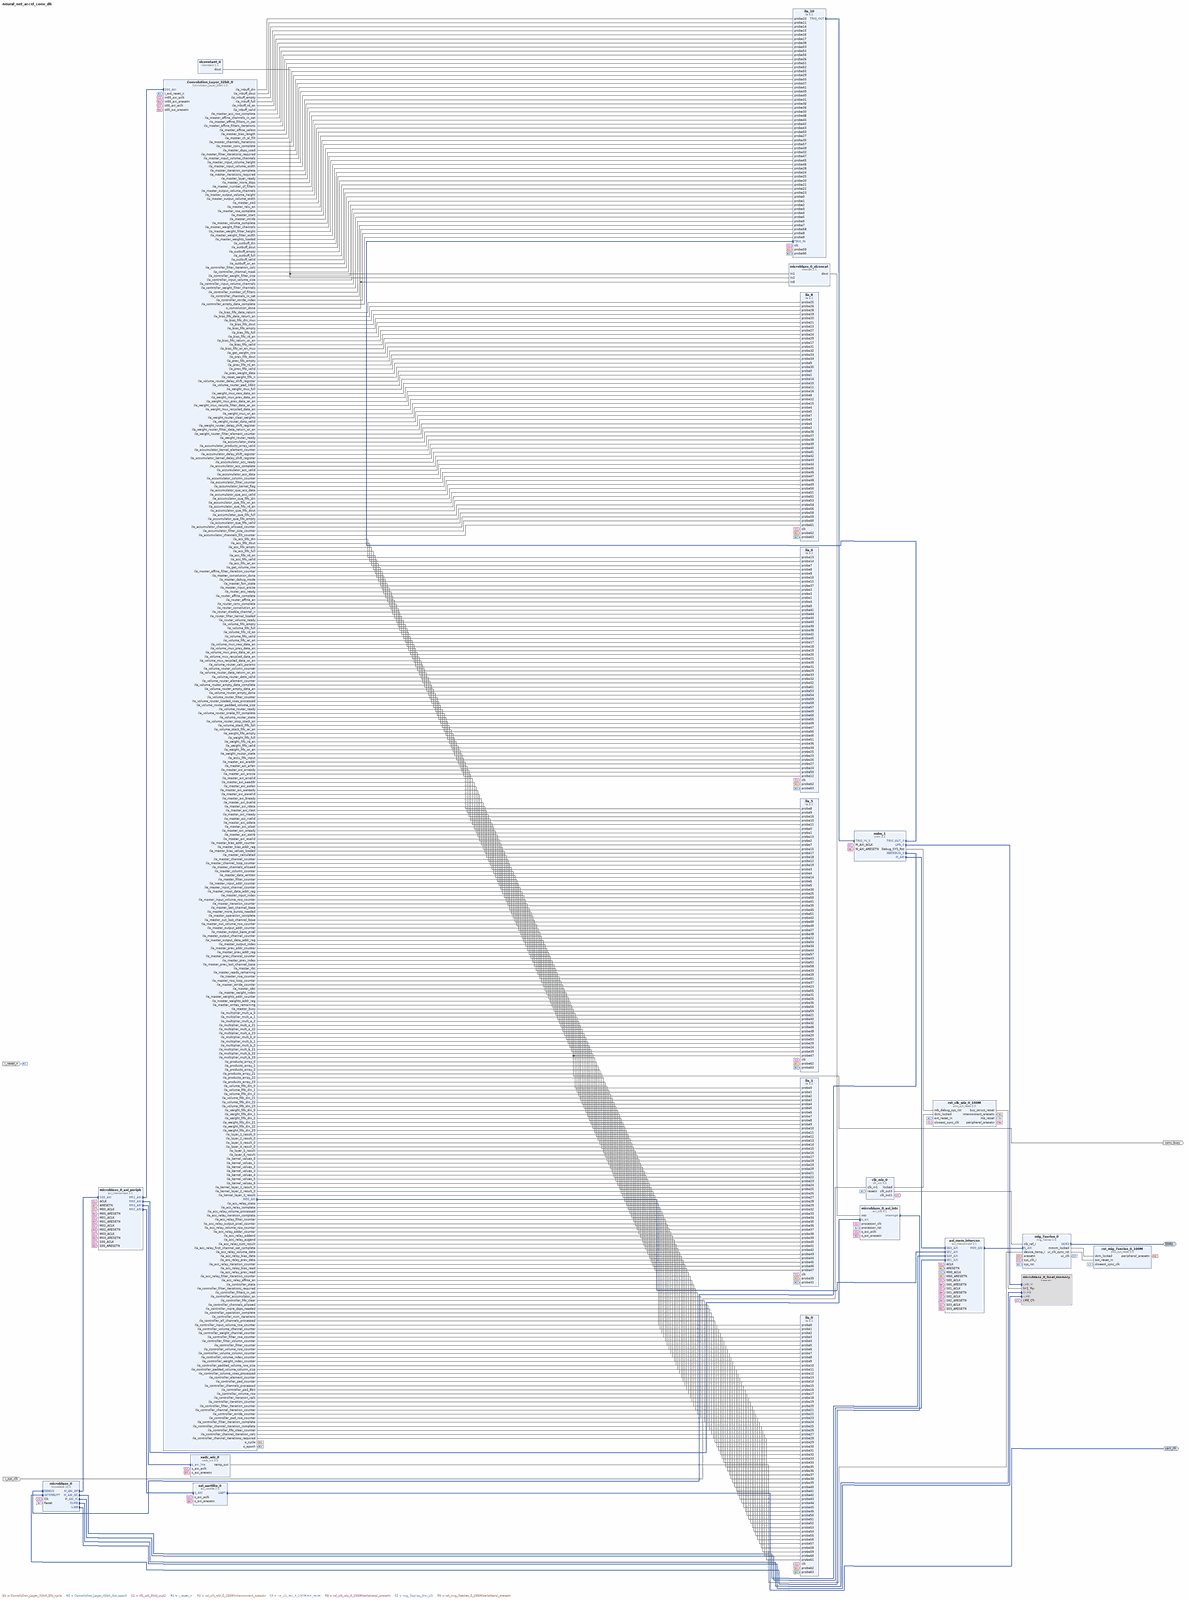
[diagram p0: block diagram of the top level, whole]
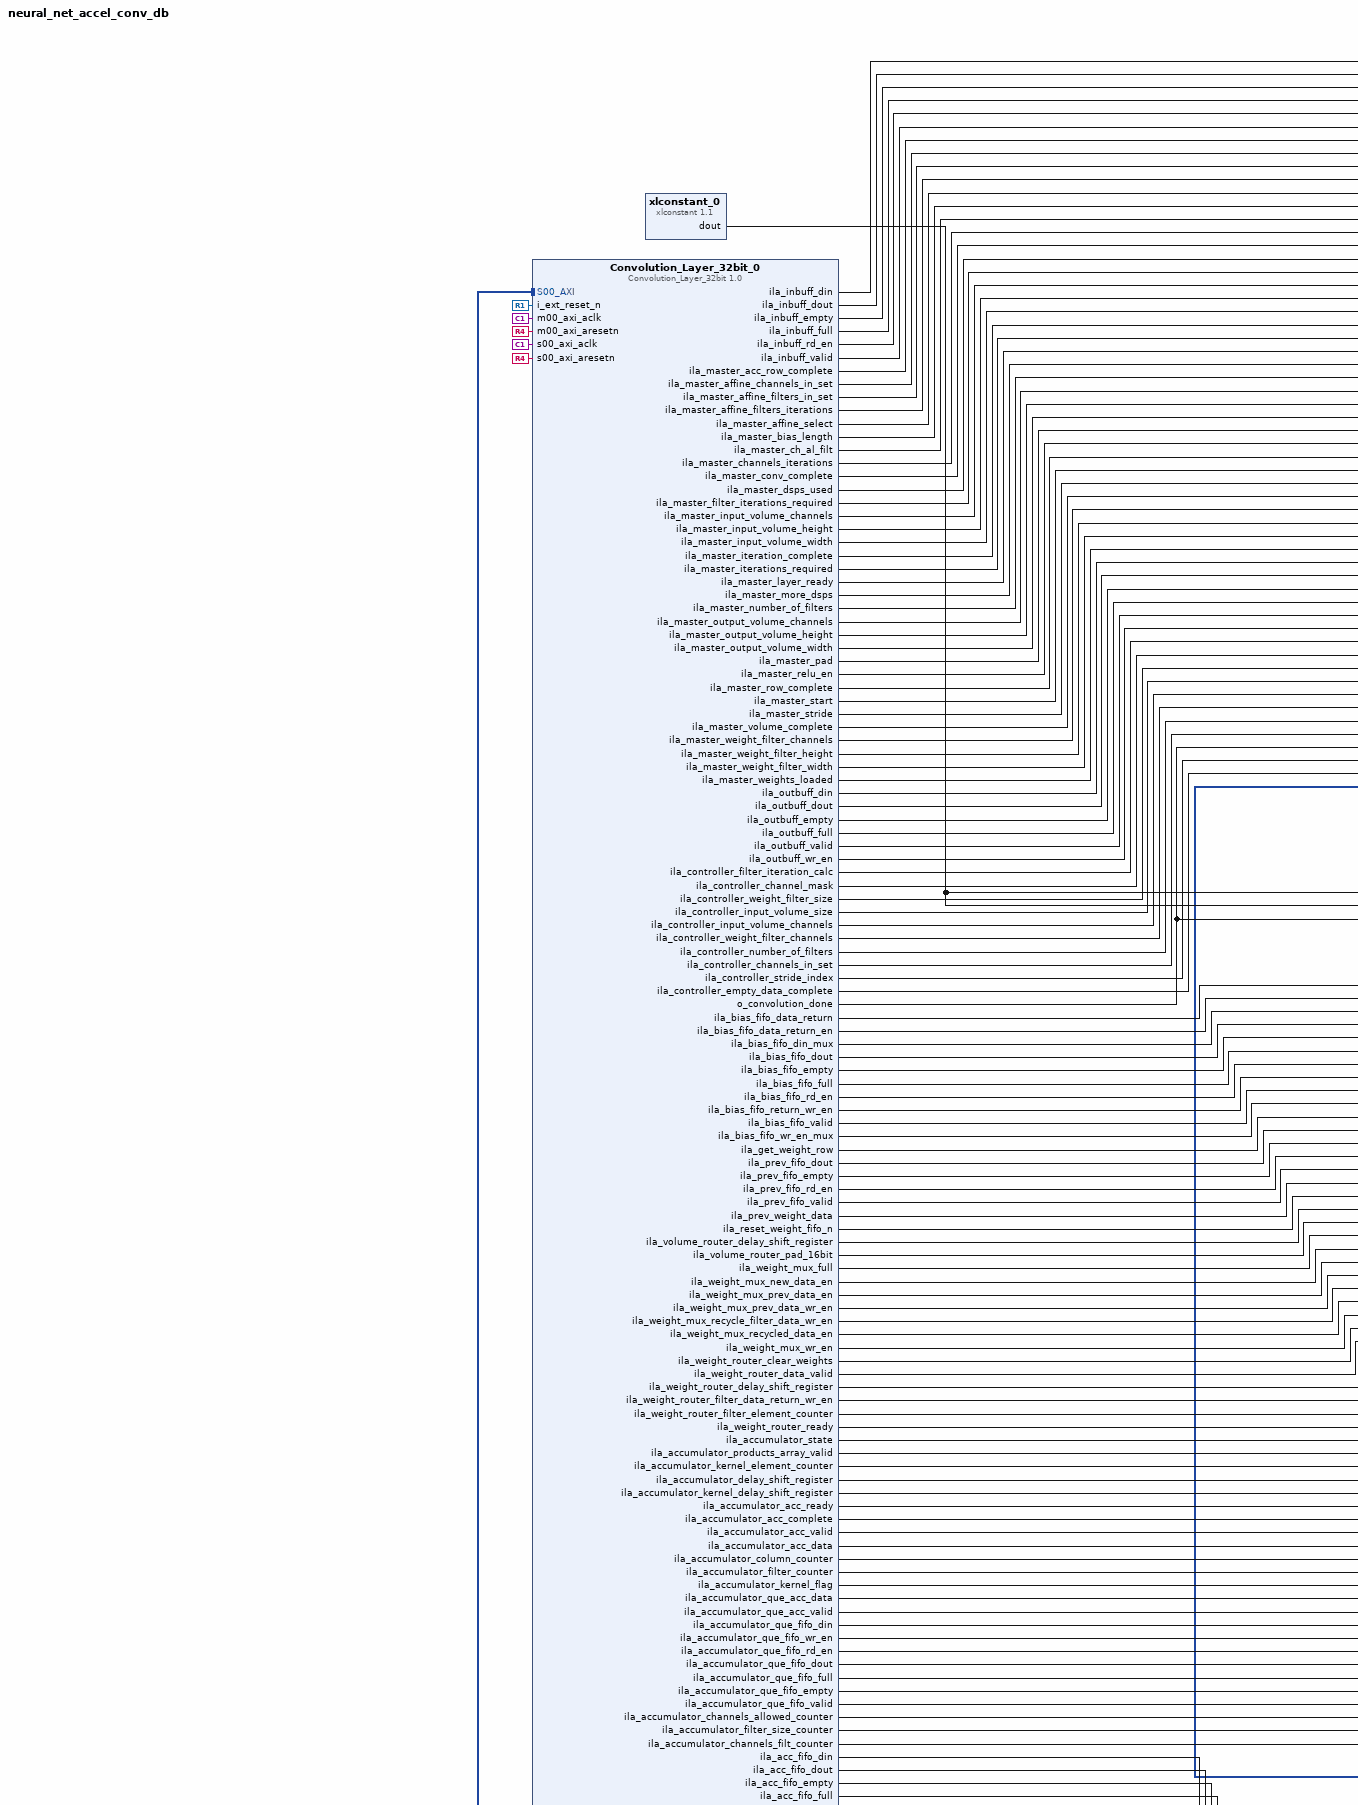
[diagram p1: block diagram of the top level, upper left part]
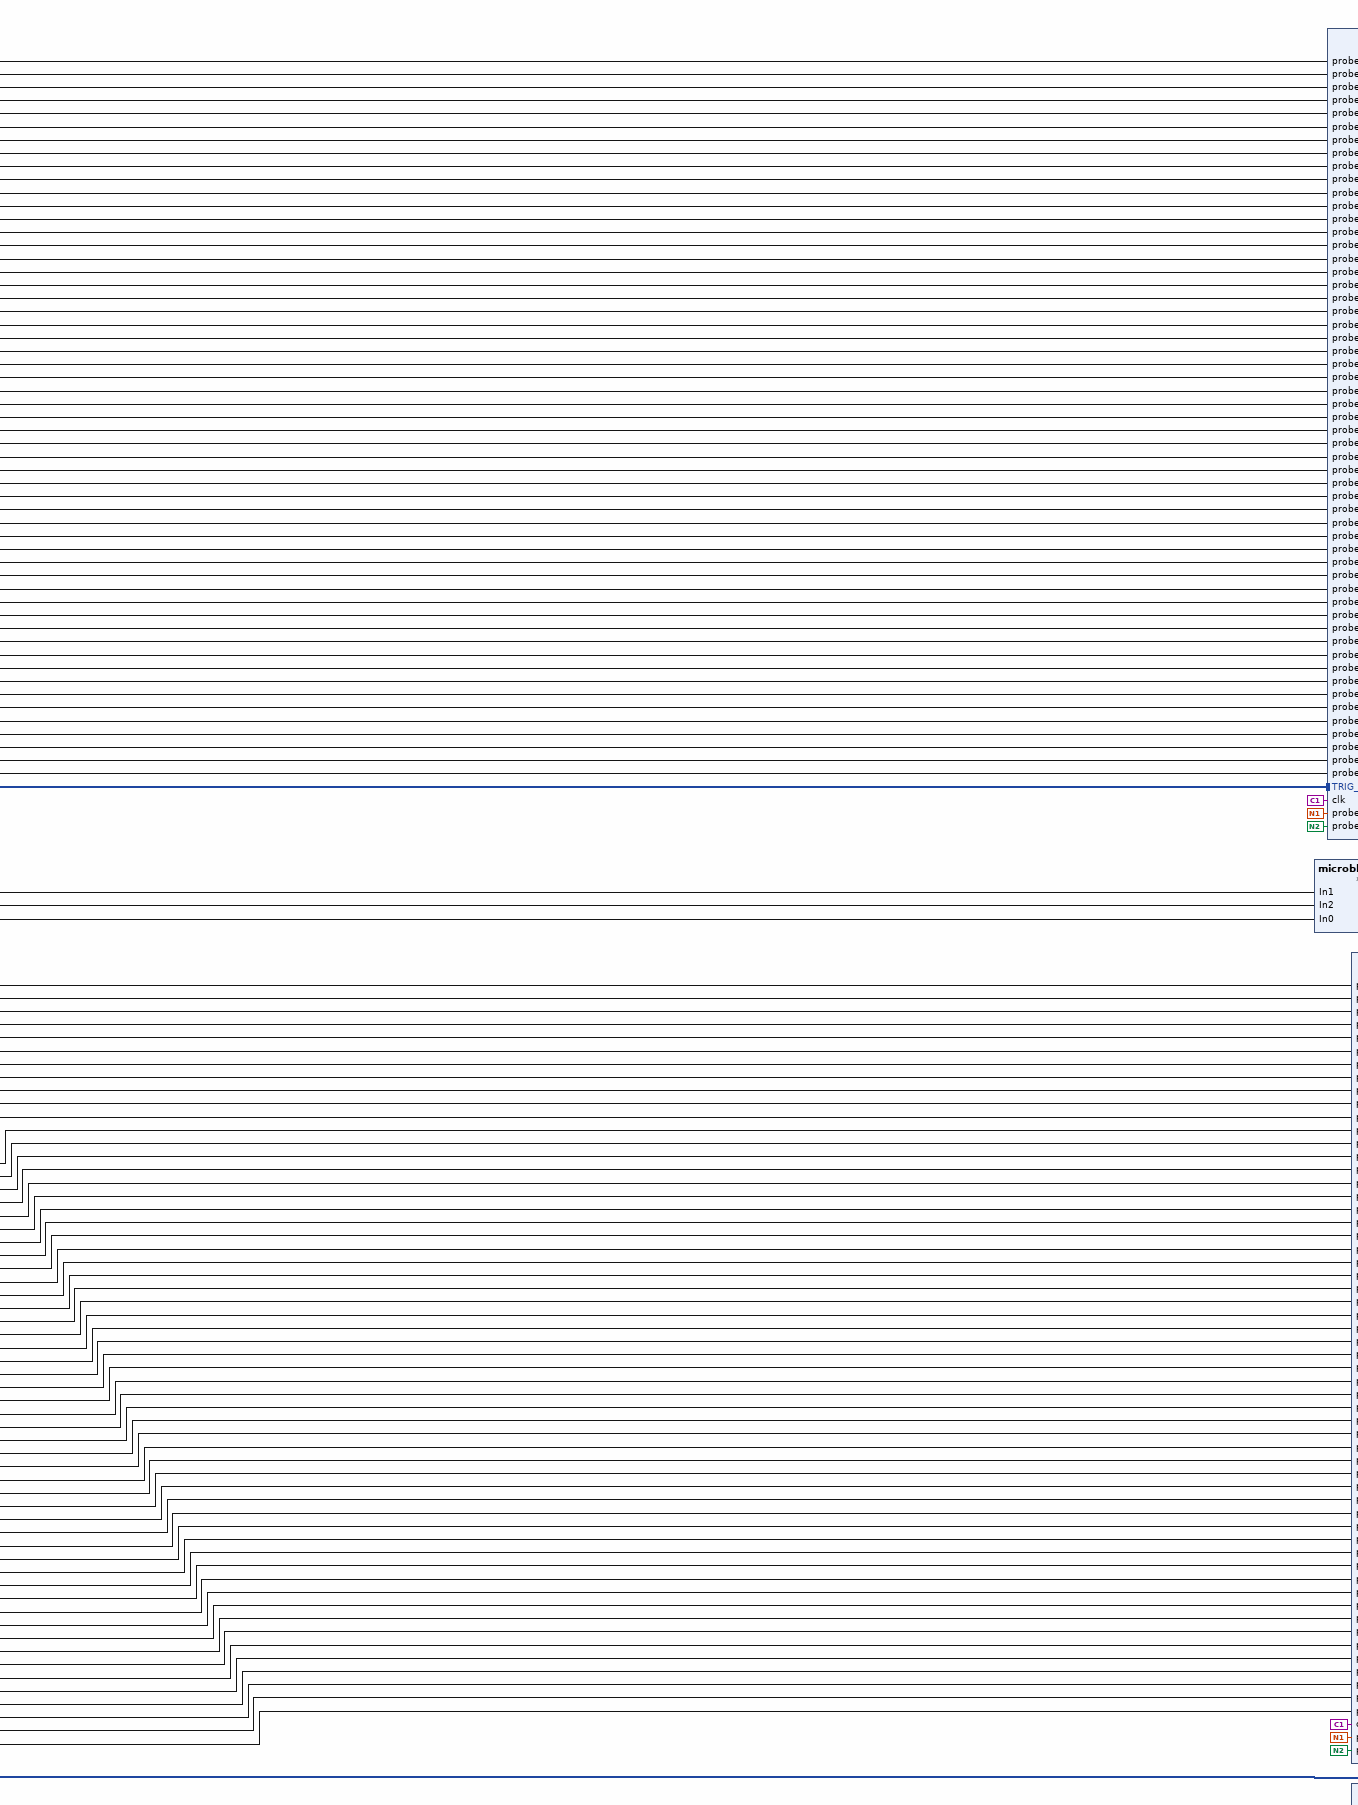
[diagram p2: block diagram of the top level, upper centre part]
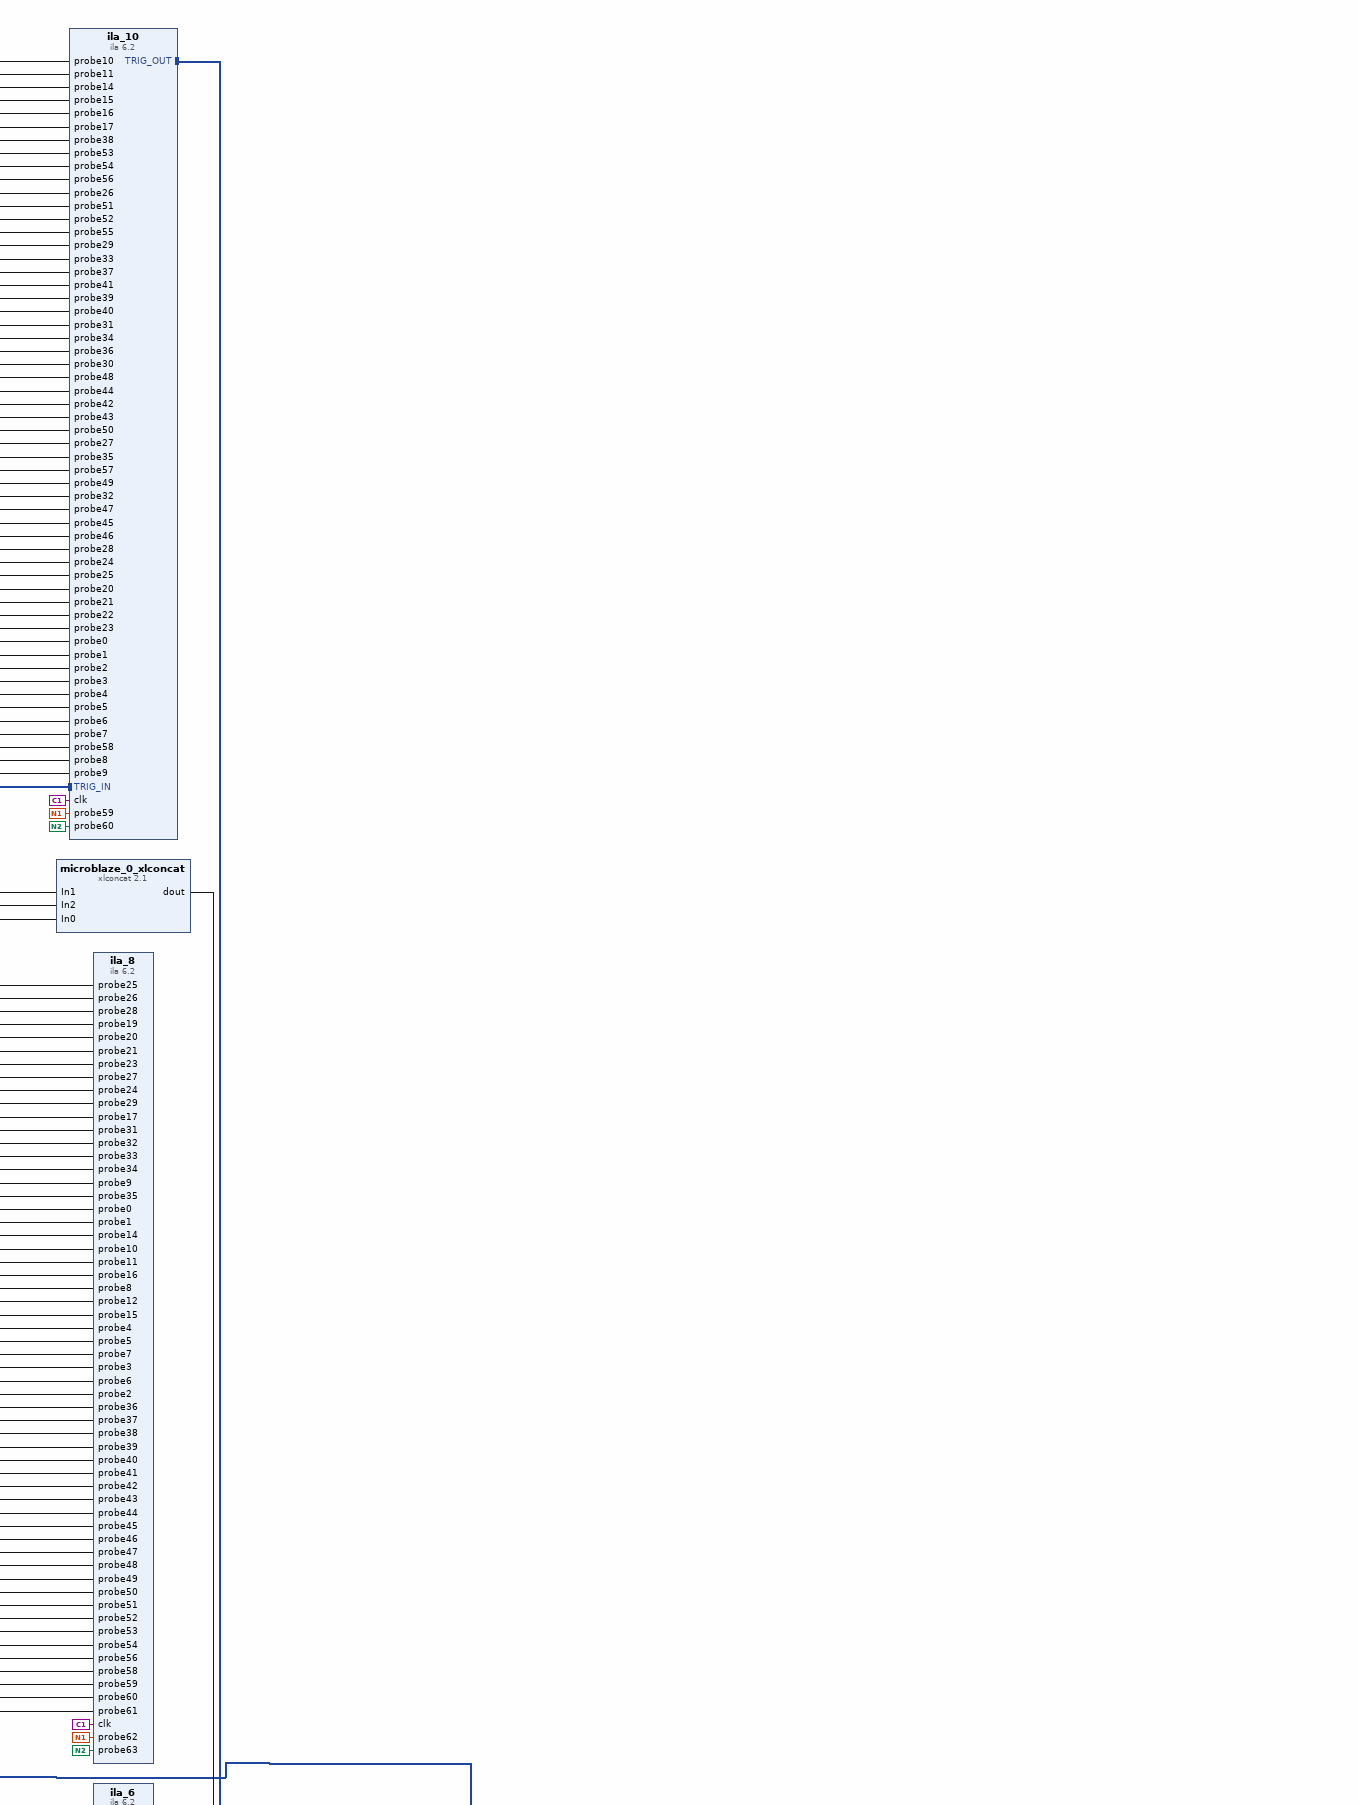
[diagram p3: block diagram of the top level, upper right part]
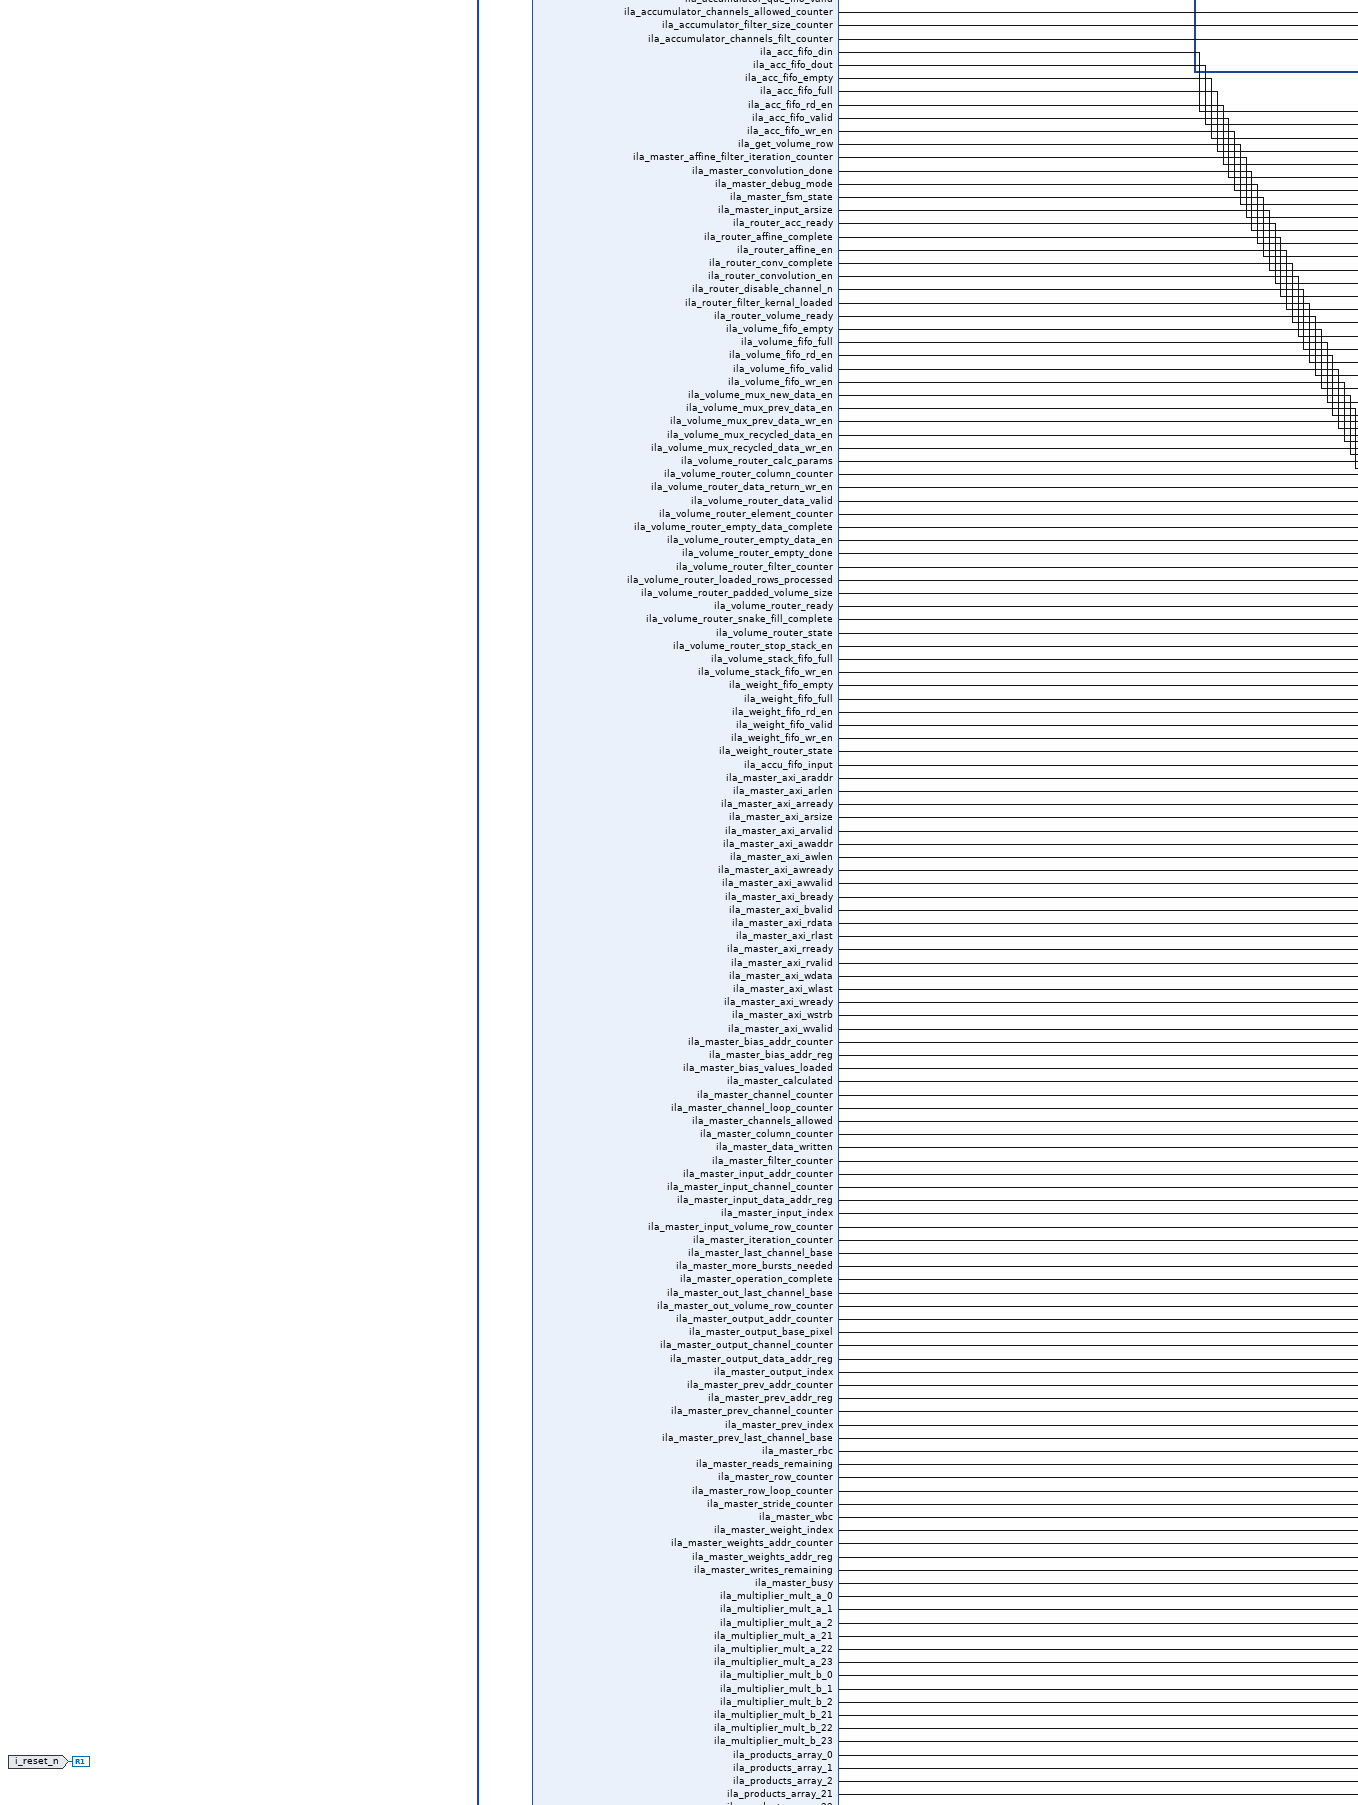
[diagram p4: block diagram of the top level, middle left part]
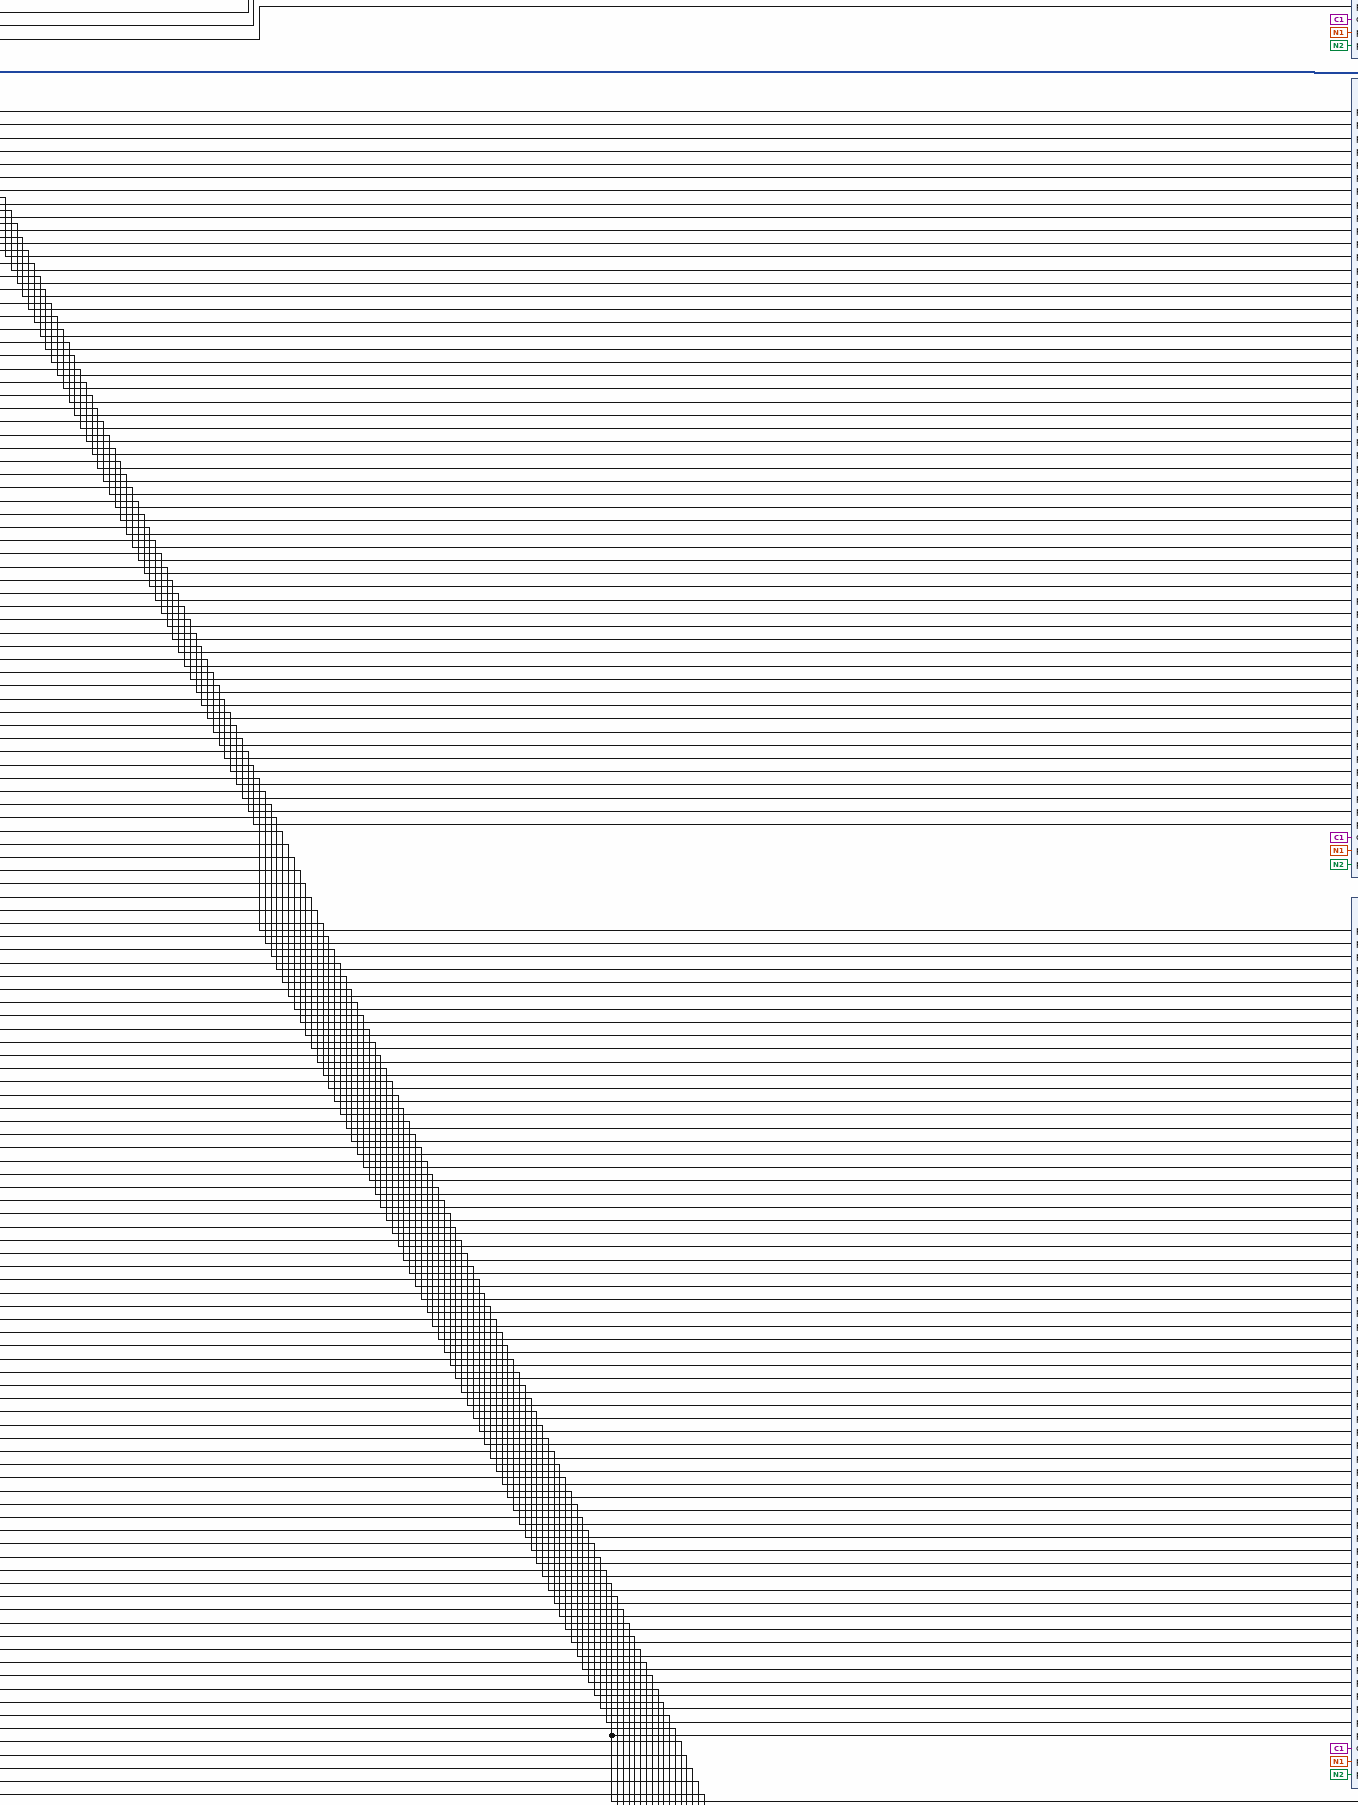
[diagram p5: block diagram of the top level, middle centre part]
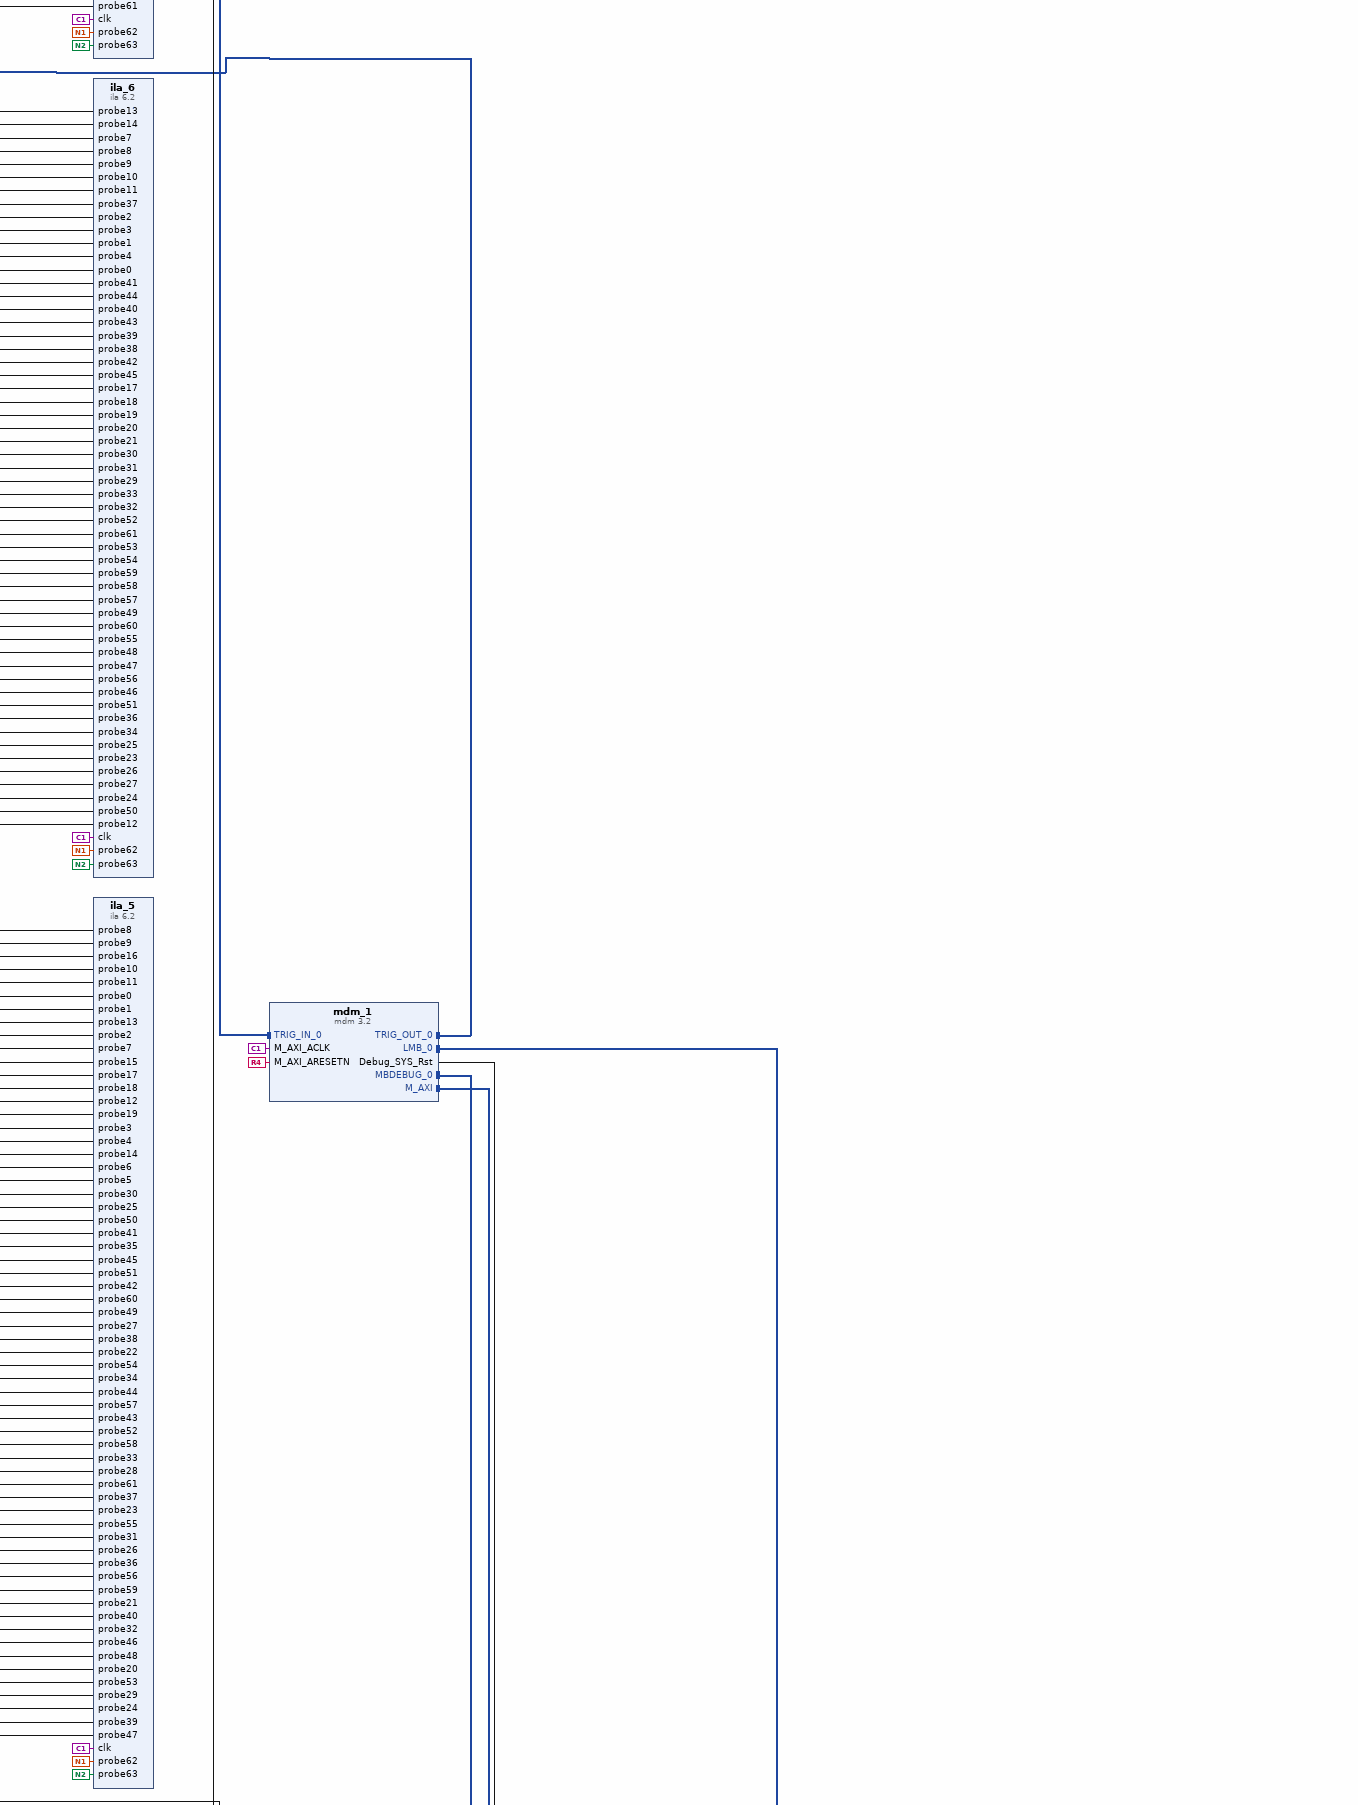
[diagram p6: block diagram of the top level, middle right part]
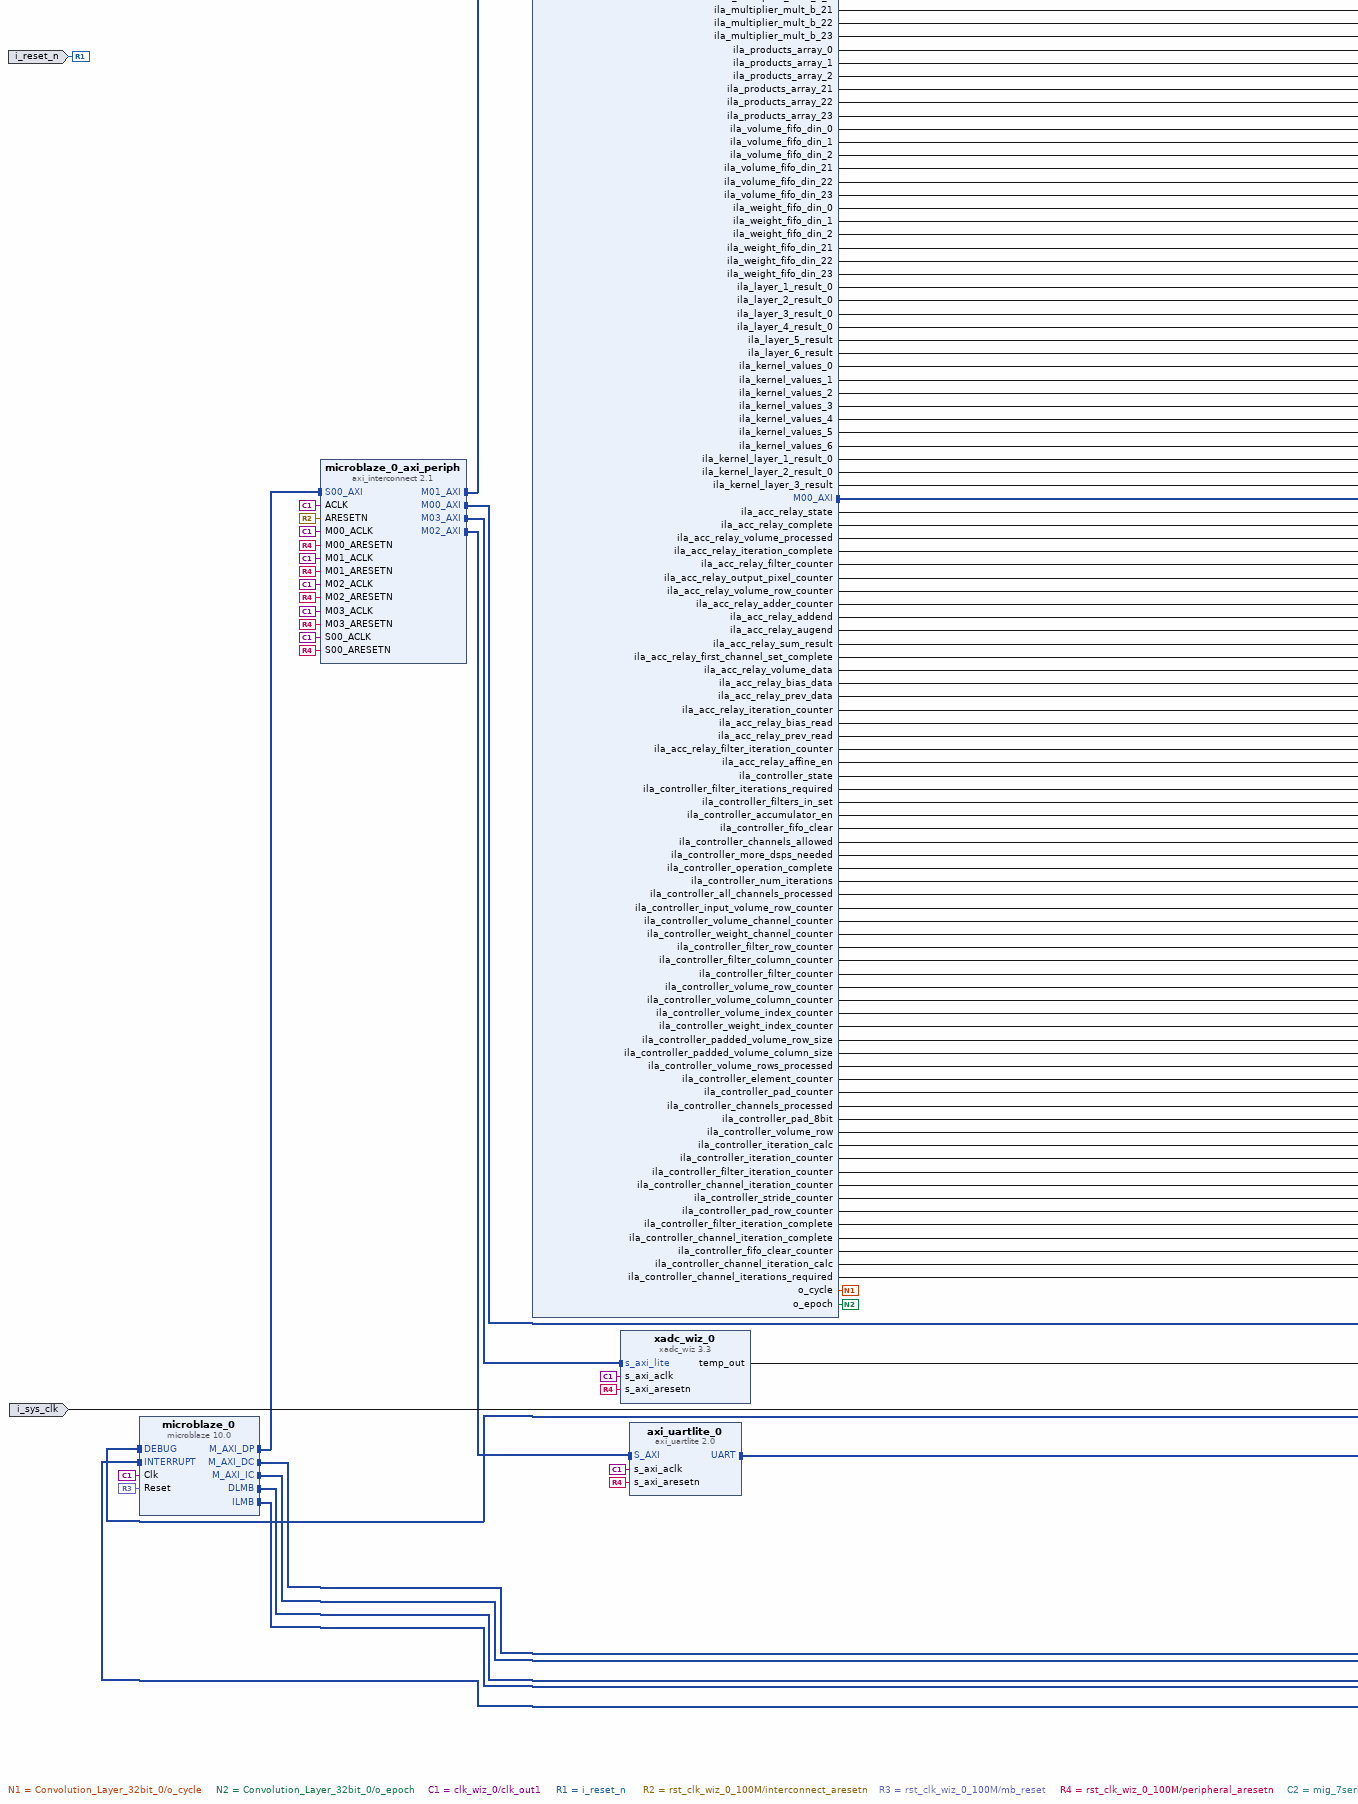
[diagram p7: block diagram of the top level, lower left part]
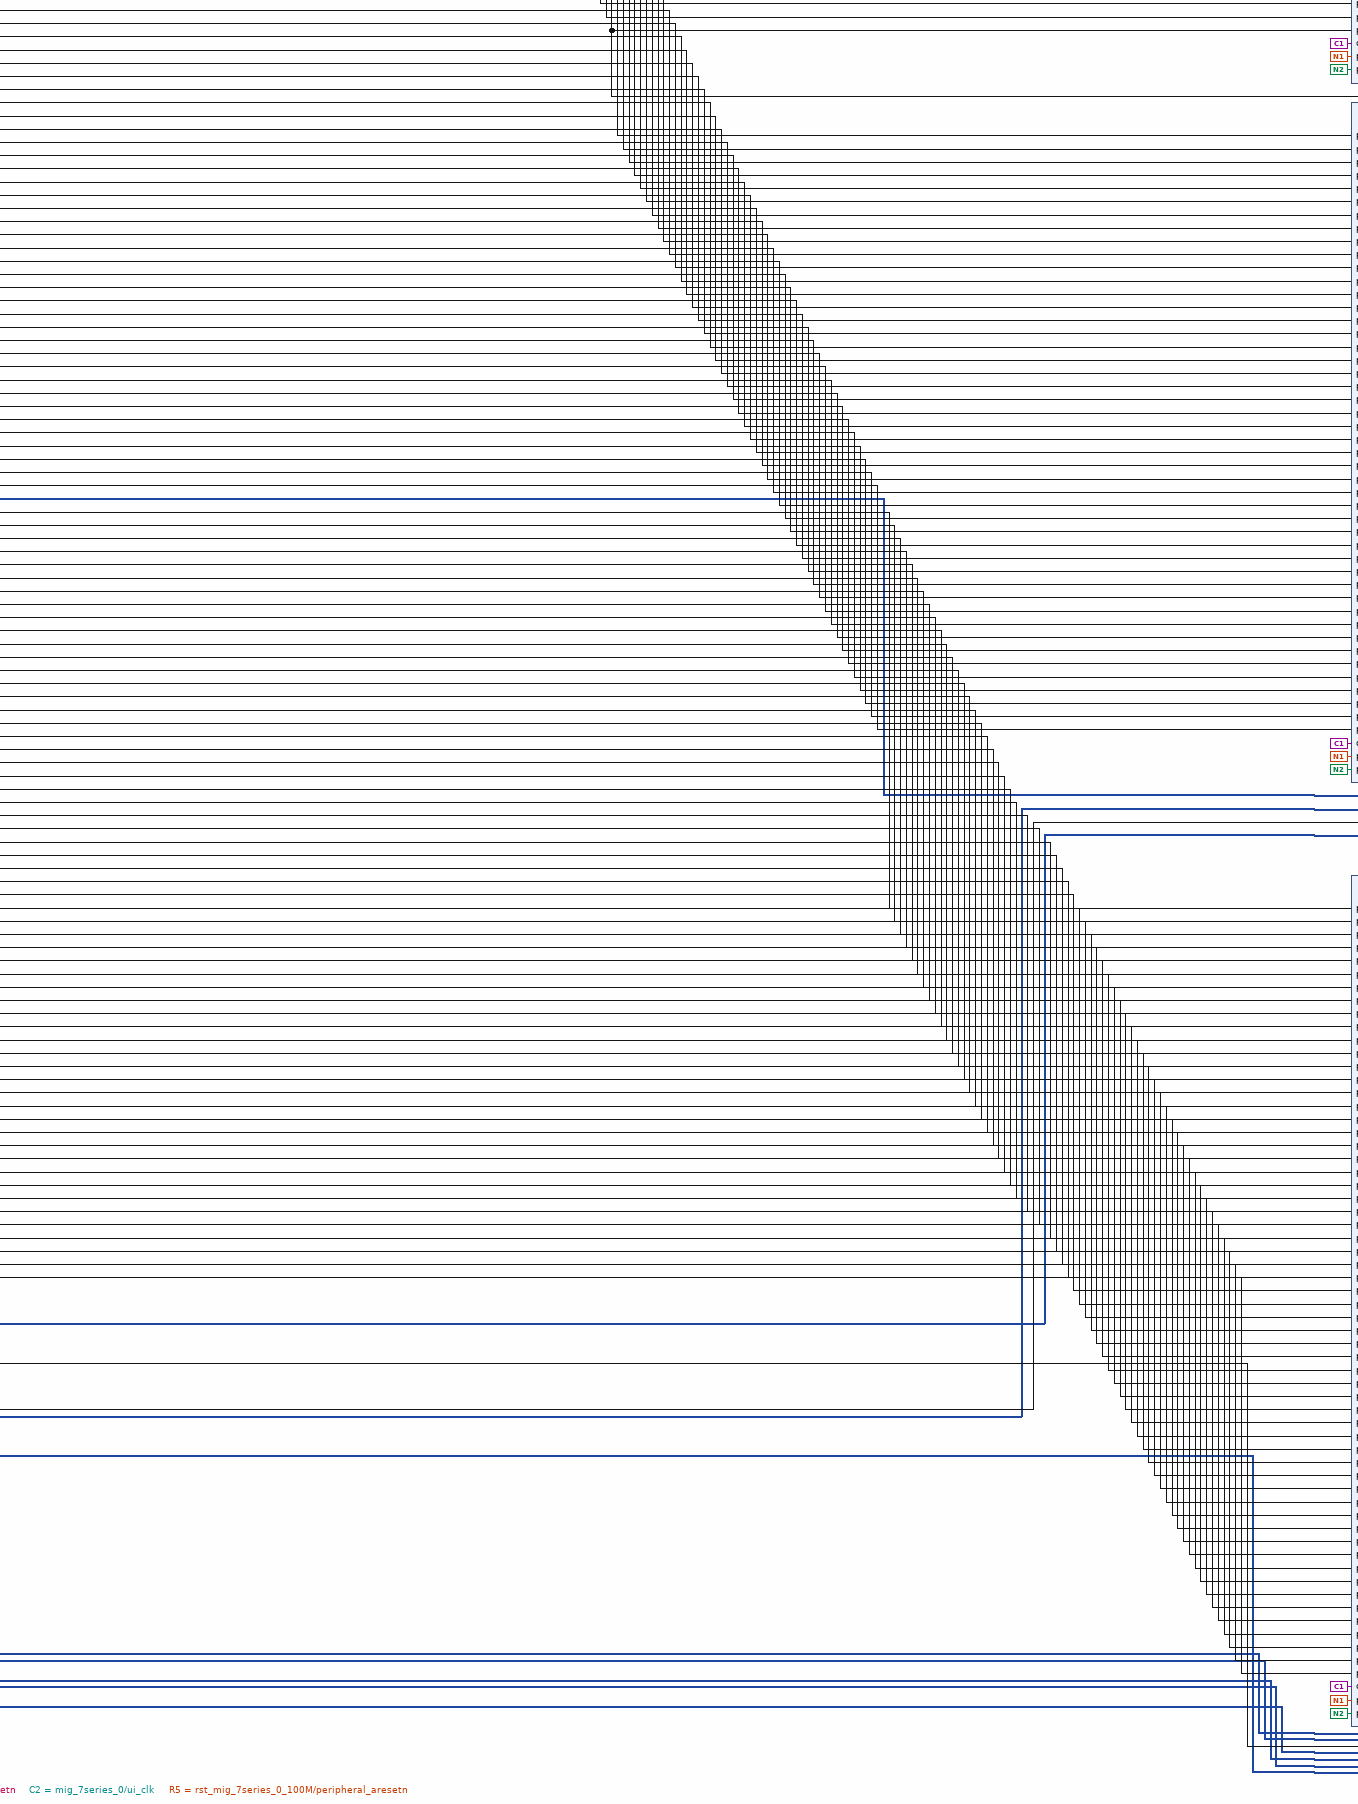
[diagram p8: block diagram of the top level, lower centre part]
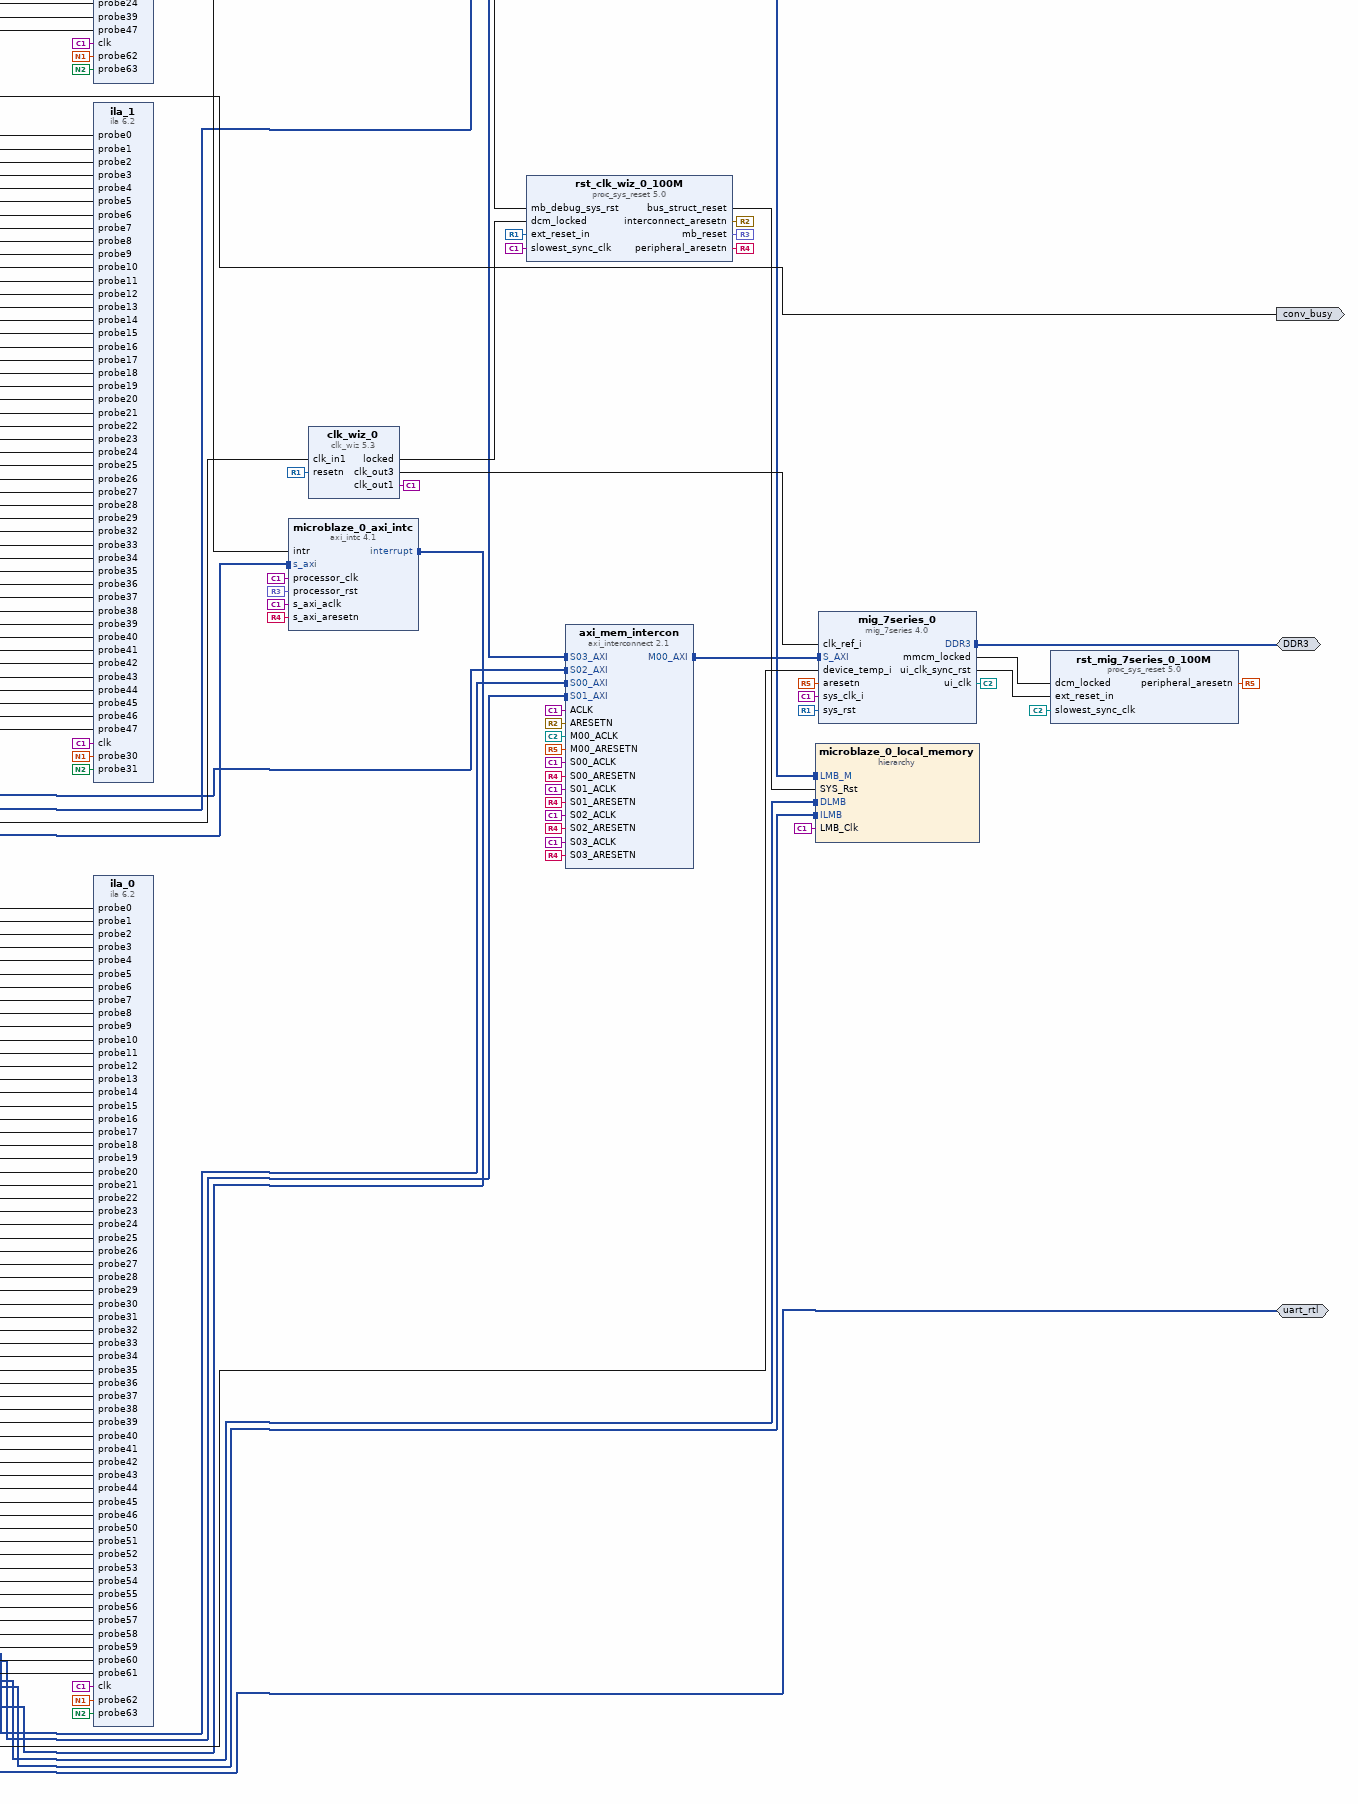
[diagram p9: block diagram of the top level, lower right part]
# Vivado block design neural_net_accel_conv_db, xc7a200tsbg484-1, Vivado 2016.4
create_bd_design neural_net_accel_conv_db

create_bd_intf_port -mode Master -vlnv xilinx.com:interface:uart_rtl:1.0 uart_rtl
create_bd_intf_port -mode Master -vlnv xilinx.com:interface:ddrx_rtl:1.0 DDR3
create_bd_port -dir O conv_busy
create_bd_port -dir I -type clk i_sys_clk
set_property -dict {CONFIG.FREQ_HZ 100000000 CONFIG.PHASE 0.000} [get_bd_ports i_sys_clk]
create_bd_port -dir I -type rst i_reset_n
set_property -dict {CONFIG.POLARITY ACTIVE_LOW} [get_bd_ports i_reset_n]

create_bd_cell -type ip -vlnv xilinx.com:ip:axi_interconnect:2.1 axi_mem_intercon
set_property -dict {CONFIG.NUM_SI 4 CONFIG.NUM_MI 1} [get_bd_cells axi_mem_intercon]
create_bd_cell -type ip -vlnv xilinx.com:ip:axi_uartlite:2.0 axi_uartlite_0
create_bd_cell -type ip -vlnv xilinx.com:ip:clk_wiz:5.3 clk_wiz_0
set_property -dict [list \
  CONFIG.CLKOUT2_USED true \
  CONFIG.CLKOUT3_USED true \
  CONFIG.NUM_OUT_CLKS 3 \
  CONFIG.CLKOUT2_REQUESTED_OUT_FREQ 25 \
  CONFIG.CLKOUT3_REQUESTED_OUT_FREQ 200 \
  CONFIG.RESET_PORT resetn \
  CONFIG.MMCM_DIVCLK_DIVIDE 1 \
  CONFIG.MMCM_CLKOUT1_DIVIDE 40 \
  CONFIG.MMCM_CLKOUT2_DIVIDE 5 \
  CONFIG.RESET_TYPE ACTIVE_LOW \
  CONFIG.CLKOUT2_JITTER 175.402 \
  CONFIG.CLKOUT2_PHASE_ERROR 98.575 \
  CONFIG.CLKOUT3_JITTER 114.829 \
  CONFIG.CLKOUT3_PHASE_ERROR 98.575 \
] [get_bd_cells clk_wiz_0]
create_bd_cell -type ip -vlnv xilinx.com:ip:ila:6.2 ila_10
set_property -dict [list \
  CONFIG.C_PROBE60_WIDTH 64 \
  CONFIG.C_PROBE59_WIDTH 64 \
  CONFIG.C_PROBE56_WIDTH 16 \
  CONFIG.C_PROBE55_WIDTH 16 \
  CONFIG.C_PROBE54_WIDTH 16 \
  CONFIG.C_PROBE53_WIDTH 16 \
  CONFIG.C_PROBE52_WIDTH 16 \
  CONFIG.C_PROBE51_WIDTH 16 \
  CONFIG.C_PROBE50_WIDTH 4 \
  CONFIG.C_PROBE49_WIDTH 4 \
  CONFIG.C_PROBE48_WIDTH 16 \
  CONFIG.C_PROBE47_WIDTH 16 \
  CONFIG.C_PROBE46_WIDTH 4 \
  CONFIG.C_PROBE45_WIDTH 4 \
  CONFIG.C_PROBE44_WIDTH 12 \
  CONFIG.C_PROBE43_WIDTH 8 \
  CONFIG.C_PROBE42_WIDTH 8 \
  CONFIG.C_PROBE41_WIDTH 16 \
  CONFIG.C_PROBE40_WIDTH 8 \
  CONFIG.C_PROBE39_WIDTH 8 \
  CONFIG.C_PROBE37_WIDTH 16 \
  CONFIG.C_PROBE34_WIDTH 8 \
  CONFIG.C_PROBE33_WIDTH 8 \
  CONFIG.C_PROBE25_WIDTH 32 \
  CONFIG.C_PROBE24_WIDTH 32 \
  CONFIG.C_PROBE11_WIDTH 32 \
  CONFIG.C_PROBE10_WIDTH 32 \
  CONFIG.C_PROBE9_WIDTH 33 \
  CONFIG.C_PROBE8_WIDTH 16 \
  CONFIG.C_PROBE7_WIDTH 8 \
  CONFIG.C_PROBE6_WIDTH 16 \
  CONFIG.C_PROBE5_WIDTH 16 \
  CONFIG.C_PROBE4_WIDTH 16 \
  CONFIG.C_PROBE3_WIDTH 16 \
  CONFIG.C_PROBE2_WIDTH 16 \
  CONFIG.C_PROBE1_WIDTH 33 \
  CONFIG.C_PROBE0_WIDTH 16 \
  CONFIG.C_NUM_OF_PROBES 61 \
  CONFIG.C_TRIGOUT_EN true \
  CONFIG.C_TRIGIN_EN true \
  CONFIG.C_ENABLE_ILA_AXI_MON false \
  CONFIG.C_MONITOR_TYPE Native \
] [get_bd_cells ila_10]
create_bd_cell -type ip -vlnv xilinx.com:ip:ila:6.2 ila_5
set_property -dict [list \
  CONFIG.C_PROBE63_WIDTH 64 \
  CONFIG.C_PROBE62_WIDTH 64 \
  CONFIG.C_PROBE61_WIDTH 32 \
  CONFIG.C_PROBE59_WIDTH 32 \
  CONFIG.C_PROBE58_WIDTH 32 \
  CONFIG.C_PROBE57_WIDTH 32 \
  CONFIG.C_PROBE56_WIDTH 32 \
  CONFIG.C_PROBE55_WIDTH 32 \
  CONFIG.C_PROBE54_WIDTH 32 \
  CONFIG.C_PROBE53_WIDTH 32 \
  CONFIG.C_PROBE51_WIDTH 16 \
  CONFIG.C_PROBE49_WIDTH 16 \
  CONFIG.C_PROBE48_WIDTH 4 \
  CONFIG.C_PROBE46_WIDTH 8 \
  CONFIG.C_PROBE45_WIDTH 16 \
  CONFIG.C_PROBE44_WIDTH 16 \
  CONFIG.C_PROBE42_WIDTH 8 \
  CONFIG.C_PROBE40_WIDTH 32 \
  CONFIG.C_PROBE39_WIDTH 16 \
  CONFIG.C_PROBE38_WIDTH 16 \
  CONFIG.C_PROBE37_WIDTH 16 \
  CONFIG.C_PROBE36_WIDTH 16 \
  CONFIG.C_PROBE35_WIDTH 16 \
  CONFIG.C_PROBE34_WIDTH 8 \
  CONFIG.C_PROBE33_WIDTH 8 \
  CONFIG.C_PROBE32_WIDTH 8 \
  CONFIG.C_PROBE31_WIDTH 32 \
  CONFIG.C_PROBE30_WIDTH 32 \
  CONFIG.C_PROBE29_WIDTH 32 \
  CONFIG.C_PROBE28_WIDTH 32 \
  CONFIG.C_PROBE27_WIDTH 32 \
  CONFIG.C_PROBE26_WIDTH 32 \
  CONFIG.C_PROBE25_WIDTH 32 \
  CONFIG.C_PROBE24_WIDTH 32 \
  CONFIG.C_PROBE23_WIDTH 32 \
  CONFIG.C_PROBE22_WIDTH 32 \
  CONFIG.C_PROBE21_WIDTH 8 \
  CONFIG.C_PROBE20_WIDTH 8 \
  CONFIG.C_PROBE17_WIDTH 32 \
  CONFIG.C_PROBE10_WIDTH 3 \
  CONFIG.C_PROBE9_WIDTH 8 \
  CONFIG.C_PROBE8_WIDTH 32 \
  CONFIG.C_PROBE6_WIDTH 4 \
  CONFIG.C_PROBE3_WIDTH 32 \
  CONFIG.C_PROBE1_WIDTH 8 \
  CONFIG.C_PROBE0_WIDTH 32 \
  CONFIG.C_NUM_OF_PROBES 64 \
  CONFIG.C_ENABLE_ILA_AXI_MON false \
  CONFIG.C_MONITOR_TYPE Native \
] [get_bd_cells ila_5]
create_bd_cell -type ip -vlnv xilinx.com:ip:ila:6.2 ila_6
set_property -dict [list \
  CONFIG.C_PROBE63_WIDTH 64 \
  CONFIG.C_PROBE62_WIDTH 64 \
  CONFIG.C_PROBE61_WIDTH 8 \
  CONFIG.C_PROBE60_WIDTH 16 \
  CONFIG.C_PROBE59_WIDTH 10 \
  CONFIG.C_PROBE58_WIDTH 33 \
  CONFIG.C_PROBE57_WIDTH 33 \
  CONFIG.C_PROBE56_WIDTH 33 \
  CONFIG.C_PROBE55_WIDTH 33 \
  CONFIG.C_PROBE54_WIDTH 33 \
  CONFIG.C_PROBE53_WIDTH 33 \
  CONFIG.C_PROBE51_WIDTH 33 \
  CONFIG.C_PROBE50_WIDTH 4 \
  CONFIG.C_PROBE48_WIDTH 16 \
  CONFIG.C_PROBE47_WIDTH 33 \
  CONFIG.C_PROBE46_WIDTH 4 \
  CONFIG.C_PROBE45_WIDTH 33 \
  CONFIG.C_PROBE44_WIDTH 33 \
  CONFIG.C_PROBE43_WIDTH 33 \
  CONFIG.C_PROBE42_WIDTH 33 \
  CONFIG.C_PROBE38_WIDTH 33 \
  CONFIG.C_PROBE37_WIDTH 33 \
  CONFIG.C_PROBE36_WIDTH 33 \
  CONFIG.C_PROBE35_WIDTH 33 \
  CONFIG.C_PROBE34_WIDTH 33 \
  CONFIG.C_PROBE33_WIDTH 33 \
  CONFIG.C_PROBE32_WIDTH 33 \
  CONFIG.C_PROBE31_WIDTH 33 \
  CONFIG.C_PROBE30_WIDTH 33 \
  CONFIG.C_PROBE29_WIDTH 33 \
  CONFIG.C_PROBE28_WIDTH 33 \
  CONFIG.C_PROBE27_WIDTH 33 \
  CONFIG.C_PROBE26_WIDTH 33 \
  CONFIG.C_PROBE25_WIDTH 33 \
  CONFIG.C_PROBE24_WIDTH 33 \
  CONFIG.C_PROBE23_WIDTH 33 \
  CONFIG.C_PROBE22_WIDTH 33 \
  CONFIG.C_PROBE21_WIDTH 33 \
  CONFIG.C_PROBE20_WIDTH 33 \
  CONFIG.C_PROBE19_WIDTH 33 \
  CONFIG.C_PROBE18_WIDTH 33 \
  CONFIG.C_PROBE17_WIDTH 33 \
  CONFIG.C_PROBE16_WIDTH 33 \
  CONFIG.C_PROBE15_WIDTH 33 \
  CONFIG.C_PROBE14_WIDTH 32 \
  CONFIG.C_PROBE13_WIDTH 32 \
  CONFIG.C_PROBE12_WIDTH 32 \
  CONFIG.C_PROBE4_WIDTH 5 \
  CONFIG.C_PROBE2_WIDTH 16 \
  CONFIG.C_PROBE0_WIDTH 3 \
  CONFIG.C_NUM_OF_PROBES 64 \
  CONFIG.C_ENABLE_ILA_AXI_MON false \
  CONFIG.C_MONITOR_TYPE Native \
] [get_bd_cells ila_6]
create_bd_cell -type ip -vlnv xilinx.com:ip:ila:6.2 ila_8
set_property -dict [list \
  CONFIG.C_PROBE63_WIDTH 64 \
  CONFIG.C_PROBE62_WIDTH 64 \
  CONFIG.C_PROBE61_WIDTH 16 \
  CONFIG.C_PROBE60_WIDTH 32 \
  CONFIG.C_PROBE59_WIDTH 32 \
  CONFIG.C_PROBE53_WIDTH 32 \
  CONFIG.C_PROBE50_WIDTH 32 \
  CONFIG.C_PROBE48_WIDTH 32 \
  CONFIG.C_PROBE46_WIDTH 32 \
  CONFIG.C_PROBE45_WIDTH 32 \
  CONFIG.C_PROBE44_WIDTH 32 \
  CONFIG.C_PROBE40_WIDTH 51 \
  CONFIG.C_PROBE39_WIDTH 78 \
  CONFIG.C_PROBE38_WIDTH 16 \
  CONFIG.C_PROBE37_WIDTH 33 \
  CONFIG.C_PROBE36_WIDTH 4 \
  CONFIG.C_PROBE31_WIDTH 32 \
  CONFIG.C_PROBE28_WIDTH 32 \
  CONFIG.C_PROBE25_WIDTH 32 \
  CONFIG.C_PROBE19_WIDTH 32 \
  CONFIG.C_PROBE17_WIDTH 33 \
  CONFIG.C_PROBE16_WIDTH 33 \
  CONFIG.C_PROBE15_WIDTH 33 \
  CONFIG.C_PROBE14_WIDTH 33 \
  CONFIG.C_PROBE13_WIDTH 33 \
  CONFIG.C_PROBE12_WIDTH 33 \
  CONFIG.C_PROBE11_WIDTH 33 \
  CONFIG.C_PROBE10_WIDTH 33 \
  CONFIG.C_PROBE9_WIDTH 32 \
  CONFIG.C_PROBE8_WIDTH 33 \
  CONFIG.C_PROBE7_WIDTH 8 \
  CONFIG.C_PROBE6_WIDTH 4 \
  CONFIG.C_PROBE5_WIDTH 33 \
  CONFIG.C_PROBE3_WIDTH 33 \
  CONFIG.C_PROBE2_WIDTH 33 \
  CONFIG.C_PROBE1_WIDTH 16 \
  CONFIG.C_PROBE0_WIDTH 8 \
  CONFIG.C_NUM_OF_PROBES 64 \
  CONFIG.C_ENABLE_ILA_AXI_MON false \
  CONFIG.C_MONITOR_TYPE Native \
] [get_bd_cells ila_8]
create_bd_cell -type ip -vlnv xilinx.com:ip:mdm:3.2 mdm_1
set_property -dict {CONFIG.C_DBG_MEM_ACCESS 1 CONFIG.C_USE_CROSS_TRIGGER 1} [get_bd_cells mdm_1]
create_bd_cell -type ip -vlnv xilinx.com:ip:microblaze:10.0 microblaze_0
set_property -dict [list \
  CONFIG.C_D_AXI 1 \
  CONFIG.C_D_LMB 1 \
  CONFIG.C_I_LMB 1 \
  CONFIG.C_DEBUG_ENABLED 2 \
  CONFIG.C_USE_ICACHE 1 \
  CONFIG.C_CACHE_BYTE_SIZE 32768 \
  CONFIG.C_ICACHE_LINE_LEN 8 \
  CONFIG.C_ICACHE_ALWAYS_USED 1 \
  CONFIG.C_USE_DCACHE 1 \
  CONFIG.C_DCACHE_BYTE_SIZE 32768 \
  CONFIG.C_DCACHE_LINE_LEN 8 \
  CONFIG.C_DCACHE_ALWAYS_USED 1 \
] [get_bd_cells microblaze_0]
create_bd_cell -type ip -vlnv xilinx.com:ip:axi_intc:4.1 microblaze_0_axi_intc
set_property -dict {CONFIG.C_HAS_FAST 1} [get_bd_cells microblaze_0_axi_intc]
create_bd_cell -type ip -vlnv xilinx.com:ip:axi_interconnect:2.1 microblaze_0_axi_periph
set_property -dict {CONFIG.NUM_SI 1 CONFIG.NUM_MI 4} [get_bd_cells microblaze_0_axi_periph]
create_bd_cell -type hier microblaze_0_local_memory
create_bd_cell -type ip -vlnv xilinx.com:ip:xlconcat:2.1 microblaze_0_xlconcat
set_property -dict {CONFIG.NUM_PORTS 3} [get_bd_cells microblaze_0_xlconcat]
create_bd_cell -type ip -vlnv xilinx.com:ip:proc_sys_reset:5.0 rst_clk_wiz_0_100M
create_bd_cell -type ip -vlnv xilinx.com:ip:xadc_wiz:3.3 xadc_wiz_0
set_property -dict {CONFIG.ENABLE_TEMP_BUS true} [get_bd_cells xadc_wiz_0]
create_bd_cell -type ip -vlnv xilinx.com:ip:mig_7series:4.0 mig_7series_0
set_property -dict [list \
  CONFIG.XML_INPUT_FILE mig_b.prj \
  CONFIG.RESET_BOARD_INTERFACE Custom \
  CONFIG.BOARD_MIG_PARAM Custom \
] [get_bd_cells mig_7series_0]
create_bd_cell -type ip -vlnv xilinx.com:ip:proc_sys_reset:5.0 rst_mig_7series_0_100M
create_bd_cell -type ip -vlnv xilinx.com:ip:xlconstant:1.1 xlconstant_0
create_bd_cell -type ip -vlnv xilinx.com:ip:ila:6.2 ila_0
set_property -dict [list \
  CONFIG.C_PROBE63_WIDTH 64 \
  CONFIG.C_PROBE62_WIDTH 64 \
  CONFIG.C_PROBE61_WIDTH 16 \
  CONFIG.C_PROBE60_WIDTH 16 \
  CONFIG.C_PROBE59_WIDTH 8 \
  CONFIG.C_PROBE56_WIDTH 4 \
  CONFIG.C_PROBE55_WIDTH 4 \
  CONFIG.C_PROBE54_WIDTH 16 \
  CONFIG.C_PROBE53_WIDTH 16 \
  CONFIG.C_PROBE52_WIDTH 16 \
  CONFIG.C_PROBE51_WIDTH 16 \
  CONFIG.C_PROBE50_WIDTH 16 \
  CONFIG.C_PROBE49_WIDTH 10 \
  CONFIG.C_PROBE48_WIDTH 16 \
  CONFIG.C_PROBE47_WIDTH 10 \
  CONFIG.C_PROBE46_WIDTH 8 \
  CONFIG.C_PROBE45_WIDTH 16 \
  CONFIG.C_PROBE44_WIDTH 4 \
  CONFIG.C_PROBE43_WIDTH 16 \
  CONFIG.C_PROBE42_WIDTH 16 \
  CONFIG.C_PROBE41_WIDTH 16 \
  CONFIG.C_PROBE40_WIDTH 16 \
  CONFIG.C_PROBE39_WIDTH 16 \
  CONFIG.C_PROBE38_WIDTH 16 \
  CONFIG.C_PROBE37_WIDTH 16 \
  CONFIG.C_PROBE36_WIDTH 16 \
  CONFIG.C_PROBE35_WIDTH 16 \
  CONFIG.C_PROBE34_WIDTH 16 \
  CONFIG.C_PROBE33_WIDTH 16 \
  CONFIG.C_PROBE32_WIDTH 16 \
  CONFIG.C_PROBE31_WIDTH 16 \
  CONFIG.C_PROBE30_WIDTH 16 \
  CONFIG.C_PROBE28_WIDTH 8 \
  CONFIG.C_PROBE25_WIDTH 8 \
  CONFIG.C_PROBE22_WIDTH 16 \
  CONFIG.C_PROBE21_WIDTH 16 \
  CONFIG.C_PROBE20_WIDTH 5 \
  CONFIG.C_PROBE18_WIDTH 16 \
  CONFIG.C_PROBE15_WIDTH 8 \
  CONFIG.C_PROBE14_WIDTH 32 \
  CONFIG.C_PROBE13_WIDTH 32 \
  CONFIG.C_PROBE12_WIDTH 32 \
  CONFIG.C_PROBE10_WIDTH 32 \
  CONFIG.C_PROBE9_WIDTH 32 \
  CONFIG.C_PROBE8_WIDTH 32 \
  CONFIG.C_PROBE7_WIDTH 8 \
  CONFIG.C_PROBE6_WIDTH 8 \
  CONFIG.C_PROBE5_WIDTH 8 \
  CONFIG.C_PROBE4_WIDTH 16 \
  CONFIG.C_PROBE0_WIDTH 4 \
  CONFIG.C_NUM_OF_PROBES 64 \
  CONFIG.C_ENABLE_ILA_AXI_MON false \
  CONFIG.C_MONITOR_TYPE Native \
] [get_bd_cells ila_0]
create_bd_cell -type ip -vlnv xilinx.com:ip:ila:6.2 ila_1
set_property -dict [list \
  CONFIG.C_PROBE47_WIDTH 32 \
  CONFIG.C_PROBE46_WIDTH 32 \
  CONFIG.C_PROBE45_WIDTH 32 \
  CONFIG.C_PROBE44_WIDTH 32 \
  CONFIG.C_PROBE43_WIDTH 32 \
  CONFIG.C_PROBE42_WIDTH 32 \
  CONFIG.C_PROBE41_WIDTH 32 \
  CONFIG.C_PROBE40_WIDTH 32 \
  CONFIG.C_PROBE39_WIDTH 32 \
  CONFIG.C_PROBE38_WIDTH 32 \
  CONFIG.C_PROBE37_WIDTH 32 \
  CONFIG.C_PROBE36_WIDTH 32 \
  CONFIG.C_PROBE35_WIDTH 32 \
  CONFIG.C_PROBE34_WIDTH 32 \
  CONFIG.C_PROBE33_WIDTH 32 \
  CONFIG.C_PROBE32_WIDTH 32 \
  CONFIG.C_PROBE29_WIDTH 32 \
  CONFIG.C_PROBE28_WIDTH 32 \
  CONFIG.C_PROBE27_WIDTH 32 \
  CONFIG.C_PROBE26_WIDTH 32 \
  CONFIG.C_PROBE25_WIDTH 32 \
  CONFIG.C_PROBE24_WIDTH 32 \
  CONFIG.C_PROBE23_WIDTH 32 \
  CONFIG.C_PROBE22_WIDTH 32 \
  CONFIG.C_PROBE21_WIDTH 32 \
  CONFIG.C_PROBE20_WIDTH 32 \
  CONFIG.C_PROBE19_WIDTH 32 \
  CONFIG.C_PROBE18_WIDTH 32 \
  CONFIG.C_PROBE17_WIDTH 32 \
  CONFIG.C_PROBE16_WIDTH 32 \
  CONFIG.C_PROBE15_WIDTH 32 \
  CONFIG.C_PROBE14_WIDTH 32 \
  CONFIG.C_PROBE13_WIDTH 32 \
  CONFIG.C_PROBE12_WIDTH 32 \
  CONFIG.C_PROBE11_WIDTH 32 \
  CONFIG.C_PROBE10_WIDTH 32 \
  CONFIG.C_PROBE9_WIDTH 32 \
  CONFIG.C_PROBE8_WIDTH 32 \
  CONFIG.C_PROBE7_WIDTH 32 \
  CONFIG.C_PROBE6_WIDTH 32 \
  CONFIG.C_PROBE5_WIDTH 32 \
  CONFIG.C_PROBE4_WIDTH 32 \
  CONFIG.C_PROBE3_WIDTH 32 \
  CONFIG.C_PROBE2_WIDTH 32 \
  CONFIG.C_PROBE1_WIDTH 32 \
  CONFIG.C_PROBE0_WIDTH 32 \
  CONFIG.C_NUM_OF_PROBES 48 \
  CONFIG.C_ENABLE_ILA_AXI_MON false \
  CONFIG.C_MONITOR_TYPE Native \
] [get_bd_cells ila_1]
create_bd_cell -type ip -vlnv xilinx.com:user:Convolution_Layer_32bit:1.0 Convolution_Layer_32bit_0

# ---- hierarchy /microblaze_0_local_memory ----
current_bd_instance /microblaze_0_local_memory
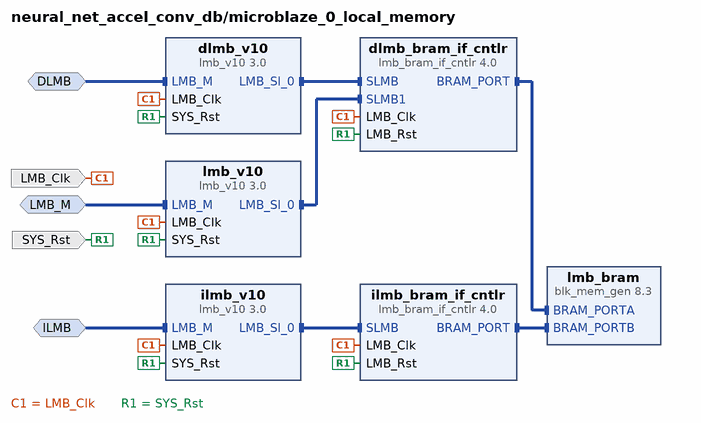
[diagram p10: block diagram inside /microblaze_0_local_memory]
create_bd_intf_pin -mode MirroredMaster -vlnv xilinx.com:interface:lmb_rtl:1.0 DLMB
create_bd_intf_pin -mode MirroredMaster -vlnv xilinx.com:interface:lmb_rtl:1.0 ILMB
create_bd_intf_pin -mode MirroredMaster -vlnv xilinx.com:interface:lmb_rtl:1.0 LMB_M
create_bd_pin -dir I -type clk LMB_Clk
create_bd_pin -dir I -type rst SYS_Rst

create_bd_cell -type ip -vlnv xilinx.com:ip:lmb_v10:3.0 dlmb_v10
create_bd_cell -type ip -vlnv xilinx.com:ip:lmb_v10:3.0 ilmb_v10
create_bd_cell -type ip -vlnv xilinx.com:ip:lmb_bram_if_cntlr:4.0 dlmb_bram_if_cntlr
set_property -dict {CONFIG.C_NUM_LMB 2 CONFIG.C_ECC 0} [get_bd_cells dlmb_bram_if_cntlr]
create_bd_cell -type ip -vlnv xilinx.com:ip:lmb_bram_if_cntlr:4.0 ilmb_bram_if_cntlr
set_property -dict {CONFIG.C_ECC 0} [get_bd_cells ilmb_bram_if_cntlr]
create_bd_cell -type ip -vlnv xilinx.com:ip:blk_mem_gen:8.3 lmb_bram
set_property -dict {CONFIG.Memory_Type True_Dual_Port_RAM CONFIG.use_bram_block BRAM_Controller} [get_bd_cells lmb_bram]
create_bd_cell -type ip -vlnv xilinx.com:ip:lmb_v10:3.0 lmb_v10

# ---- connections ----

current_bd_instance /microblaze_0_local_memory
connect_bd_intf_net -intf_net microblaze_0_dlmb_bus [get_bd_intf_pins dlmb_v10/LMB_Sl_0] [get_bd_intf_pins dlmb_bram_if_cntlr/SLMB]
connect_bd_intf_net -intf_net microblaze_0_ilmb_bus [get_bd_intf_pins ilmb_v10/LMB_Sl_0] [get_bd_intf_pins ilmb_bram_if_cntlr/SLMB]
connect_bd_intf_net -intf_net microblaze_0_dlmb_cntlr [get_bd_intf_pins dlmb_bram_if_cntlr/BRAM_PORT] [get_bd_intf_pins lmb_bram/BRAM_PORTA]
connect_bd_intf_net -intf_net microblaze_0_ilmb_cntlr [get_bd_intf_pins ilmb_bram_if_cntlr/BRAM_PORT] [get_bd_intf_pins lmb_bram/BRAM_PORTB]
connect_bd_intf_net -intf_net microblaze_0_lmb_bus [get_bd_intf_pins lmb_v10/LMB_Sl_0] [get_bd_intf_pins dlmb_bram_if_cntlr/SLMB1]
connect_bd_intf_net -intf_net microblaze_0_dlmb [get_bd_intf_pins DLMB] [get_bd_intf_pins dlmb_v10/LMB_M]
connect_bd_intf_net -intf_net microblaze_0_ilmb [get_bd_intf_pins ILMB] [get_bd_intf_pins ilmb_v10/LMB_M]
connect_bd_intf_net -intf_net microblaze_0_lmb [get_bd_intf_pins LMB_M] [get_bd_intf_pins lmb_v10/LMB_M]
connect_bd_net -net microblaze_0_Clk [get_bd_pins LMB_Clk] \
  [get_bd_pins dlmb_v10/LMB_Clk] [get_bd_pins dlmb_bram_if_cntlr/LMB_Clk] [get_bd_pins ilmb_v10/LMB_Clk] \
  [get_bd_pins ilmb_bram_if_cntlr/LMB_Clk] [get_bd_pins lmb_v10/LMB_Clk]
connect_bd_net [get_bd_pins SYS_Rst] \
  [get_bd_pins dlmb_v10/SYS_Rst] [get_bd_pins dlmb_bram_if_cntlr/LMB_Rst] [get_bd_pins ilmb_v10/SYS_Rst] \
  [get_bd_pins ilmb_bram_if_cntlr/LMB_Rst] [get_bd_pins lmb_v10/SYS_Rst]

current_bd_instance /
connect_bd_intf_net [get_bd_intf_pins Convolution_Layer_32bit_0/M00_AXI] [get_bd_intf_pins axi_mem_intercon/S02_AXI]
connect_bd_intf_net [get_bd_intf_pins microblaze_0/M_AXI_DC] [get_bd_intf_pins axi_mem_intercon/S00_AXI]
connect_bd_intf_net [get_bd_intf_pins microblaze_0/M_AXI_DP] [get_bd_intf_pins microblaze_0_axi_periph/S00_AXI]
connect_bd_intf_net [get_bd_intf_pins microblaze_0/M_AXI_IC] [get_bd_intf_pins axi_mem_intercon/S01_AXI]
connect_bd_intf_net [get_bd_intf_pins microblaze_0_axi_intc/interrupt] [get_bd_intf_pins microblaze_0/INTERRUPT]
connect_bd_intf_net [get_bd_intf_pins microblaze_0_axi_periph/M01_AXI] [get_bd_intf_pins Convolution_Layer_32bit_0/S00_AXI]
connect_bd_intf_net [get_bd_intf_pins mdm_1/MBDEBUG_0] [get_bd_intf_pins microblaze_0/DEBUG]
connect_bd_intf_net [get_bd_intf_pins microblaze_0/DLMB] [get_bd_intf_pins microblaze_0_local_memory/DLMB]
connect_bd_intf_net [get_bd_intf_pins microblaze_0/ILMB] [get_bd_intf_pins microblaze_0_local_memory/ILMB]
connect_bd_intf_net -intf_net microblaze_0_intc_axi [get_bd_intf_pins microblaze_0_axi_periph/M00_AXI] [get_bd_intf_pins microblaze_0_axi_intc/s_axi]
connect_bd_intf_net -intf_net microblaze_0_lmb [get_bd_intf_pins mdm_1/LMB_0] [get_bd_intf_pins microblaze_0_local_memory/LMB_M]
connect_bd_intf_net [get_bd_intf_pins axi_mem_intercon/M00_AXI] [get_bd_intf_pins mig_7series_0/S_AXI]
connect_bd_intf_net [get_bd_intf_pins mdm_1/TRIG_IN_0] [get_bd_intf_pins ila_10/TRIG_OUT]
connect_bd_intf_net [get_bd_intf_pins mdm_1/TRIG_OUT_0] [get_bd_intf_pins ila_10/TRIG_IN]
connect_bd_intf_net [get_bd_intf_pins mdm_1/M_AXI] [get_bd_intf_pins axi_mem_intercon/S03_AXI]
connect_bd_intf_net [get_bd_intf_pins microblaze_0_axi_periph/M03_AXI] [get_bd_intf_pins xadc_wiz_0/s_axi_lite]
connect_bd_intf_net [get_bd_intf_pins microblaze_0_axi_periph/M02_AXI] [get_bd_intf_pins axi_uartlite_0/S_AXI]
connect_bd_intf_net [get_bd_intf_ports uart_rtl] [get_bd_intf_pins axi_uartlite_0/UART]
connect_bd_intf_net [get_bd_intf_ports DDR3] [get_bd_intf_pins mig_7series_0/DDR3]
connect_bd_net [get_bd_pins Convolution_Layer_32bit_0/ila_acc_fifo_din] [get_bd_pins ila_6/probe13]
connect_bd_net [get_bd_pins Convolution_Layer_32bit_0/ila_acc_fifo_dout] [get_bd_pins ila_6/probe14]
connect_bd_net [get_bd_pins Convolution_Layer_32bit_0/ila_acc_fifo_empty] [get_bd_pins ila_6/probe7]
connect_bd_net [get_bd_pins Convolution_Layer_32bit_0/ila_acc_fifo_full] [get_bd_pins ila_6/probe8]
connect_bd_net [get_bd_pins Convolution_Layer_32bit_0/ila_acc_fifo_rd_en] [get_bd_pins ila_6/probe9]
connect_bd_net [get_bd_pins Convolution_Layer_32bit_0/ila_acc_fifo_valid] [get_bd_pins ila_6/probe10]
connect_bd_net [get_bd_pins Convolution_Layer_32bit_0/ila_acc_fifo_wr_en] [get_bd_pins ila_6/probe11]
connect_bd_net [get_bd_pins Convolution_Layer_32bit_0/ila_bias_fifo_data_return] [get_bd_pins ila_8/probe25]
connect_bd_net [get_bd_pins Convolution_Layer_32bit_0/ila_bias_fifo_data_return_en] [get_bd_pins ila_8/probe26]
connect_bd_net [get_bd_pins Convolution_Layer_32bit_0/ila_bias_fifo_din_mux] [get_bd_pins ila_8/probe28]
connect_bd_net [get_bd_pins Convolution_Layer_32bit_0/ila_bias_fifo_dout] [get_bd_pins ila_8/probe19]
connect_bd_net [get_bd_pins Convolution_Layer_32bit_0/ila_bias_fifo_empty] [get_bd_pins ila_8/probe20]
connect_bd_net [get_bd_pins Convolution_Layer_32bit_0/ila_bias_fifo_full] [get_bd_pins ila_8/probe21]
connect_bd_net [get_bd_pins Convolution_Layer_32bit_0/ila_bias_fifo_rd_en] [get_bd_pins ila_8/probe23]
connect_bd_net [get_bd_pins Convolution_Layer_32bit_0/ila_bias_fifo_return_wr_en] [get_bd_pins ila_8/probe27]
connect_bd_net [get_bd_pins Convolution_Layer_32bit_0/ila_bias_fifo_valid] [get_bd_pins ila_8/probe24]
connect_bd_net [get_bd_pins Convolution_Layer_32bit_0/ila_bias_fifo_wr_en_mux] [get_bd_pins ila_8/probe29]
connect_bd_net [get_bd_pins Convolution_Layer_32bit_0/ila_get_volume_row] [get_bd_pins ila_6/probe37]
connect_bd_net [get_bd_pins Convolution_Layer_32bit_0/ila_get_weight_row] [get_bd_pins ila_8/probe17]
connect_bd_net [get_bd_pins Convolution_Layer_32bit_0/ila_inbuff_din] [get_bd_pins ila_10/probe10]
connect_bd_net [get_bd_pins Convolution_Layer_32bit_0/ila_inbuff_dout] [get_bd_pins ila_10/probe11]
connect_bd_net [get_bd_pins Convolution_Layer_32bit_0/ila_inbuff_empty] [get_bd_pins ila_10/probe14]
connect_bd_net [get_bd_pins Convolution_Layer_32bit_0/ila_inbuff_full] [get_bd_pins ila_10/probe15]
connect_bd_net [get_bd_pins Convolution_Layer_32bit_0/ila_inbuff_rd_en] [get_bd_pins ila_10/probe16]
connect_bd_net [get_bd_pins Convolution_Layer_32bit_0/ila_inbuff_valid] [get_bd_pins ila_10/probe17]
connect_bd_net [get_bd_pins Convolution_Layer_32bit_0/ila_master_acc_row_complete] [get_bd_pins ila_10/probe38]
connect_bd_net [get_bd_pins Convolution_Layer_32bit_0/ila_master_affine_channels_in_set] [get_bd_pins ila_10/probe53]
connect_bd_net [get_bd_pins Convolution_Layer_32bit_0/ila_master_affine_filter_iteration_counter] [get_bd_pins ila_6/probe2]
connect_bd_net [get_bd_pins Convolution_Layer_32bit_0/ila_master_affine_filters_in_set] [get_bd_pins ila_10/probe54]
connect_bd_net [get_bd_pins Convolution_Layer_32bit_0/ila_master_affine_filters_iterations] [get_bd_pins ila_10/probe56]
connect_bd_net [get_bd_pins Convolution_Layer_32bit_0/ila_master_affine_select] [get_bd_pins ila_10/probe26]
connect_bd_net [get_bd_pins Convolution_Layer_32bit_0/ila_master_axi_araddr] [get_bd_pins ila_5/probe8]
connect_bd_net [get_bd_pins Convolution_Layer_32bit_0/ila_master_axi_arlen] [get_bd_pins ila_5/probe9]
connect_bd_net [get_bd_pins Convolution_Layer_32bit_0/ila_master_axi_arready] [get_bd_pins ila_5/probe16]
connect_bd_net [get_bd_pins Convolution_Layer_32bit_0/ila_master_axi_arsize] [get_bd_pins ila_5/probe10]
connect_bd_net [get_bd_pins Convolution_Layer_32bit_0/ila_master_axi_arvalid] [get_bd_pins ila_5/probe11]
connect_bd_net [get_bd_pins Convolution_Layer_32bit_0/ila_master_axi_awaddr] [get_bd_pins ila_5/probe0]
connect_bd_net [get_bd_pins Convolution_Layer_32bit_0/ila_master_axi_awlen] [get_bd_pins ila_5/probe1]
connect_bd_net [get_bd_pins Convolution_Layer_32bit_0/ila_master_axi_awready] [get_bd_pins ila_5/probe13]
connect_bd_net [get_bd_pins Convolution_Layer_32bit_0/ila_master_axi_awvalid] [get_bd_pins ila_5/probe2]
connect_bd_net [get_bd_pins Convolution_Layer_32bit_0/ila_master_axi_bready] [get_bd_pins ila_5/probe7]
connect_bd_net [get_bd_pins Convolution_Layer_32bit_0/ila_master_axi_bvalid] [get_bd_pins ila_5/probe15]
connect_bd_net [get_bd_pins Convolution_Layer_32bit_0/ila_master_axi_rdata] [get_bd_pins ila_5/probe17]
connect_bd_net [get_bd_pins Convolution_Layer_32bit_0/ila_master_axi_rlast] [get_bd_pins ila_5/probe18]
connect_bd_net [get_bd_pins Convolution_Layer_32bit_0/ila_master_axi_rready] [get_bd_pins ila_5/probe12]
connect_bd_net [get_bd_pins Convolution_Layer_32bit_0/ila_master_axi_rvalid] [get_bd_pins ila_5/probe19]
connect_bd_net [get_bd_pins Convolution_Layer_32bit_0/ila_master_axi_wdata] [get_bd_pins ila_5/probe3]
connect_bd_net [get_bd_pins Convolution_Layer_32bit_0/ila_master_axi_wlast] [get_bd_pins ila_5/probe4]
connect_bd_net [get_bd_pins Convolution_Layer_32bit_0/ila_master_axi_wready] [get_bd_pins ila_5/probe14]
connect_bd_net [get_bd_pins Convolution_Layer_32bit_0/ila_master_axi_wstrb] [get_bd_pins ila_5/probe6]
connect_bd_net [get_bd_pins Convolution_Layer_32bit_0/ila_master_axi_wvalid] [get_bd_pins ila_5/probe5]
connect_bd_net [get_bd_pins Convolution_Layer_32bit_0/ila_master_bias_addr_counter] [get_bd_pins ila_5/probe30]
connect_bd_net [get_bd_pins Convolution_Layer_32bit_0/ila_master_bias_addr_reg] [get_bd_pins ila_5/probe25]
connect_bd_net [get_bd_pins Convolution_Layer_32bit_0/ila_master_bias_length] [get_bd_pins ila_10/probe51]
connect_bd_net [get_bd_pins Convolution_Layer_32bit_0/ila_master_bias_values_loaded] [get_bd_pins ila_5/probe50]
connect_bd_net [get_bd_pins Convolution_Layer_32bit_0/ila_master_busy] [get_bd_ports conv_busy] [get_bd_pins ila_5/probe47]
connect_bd_net [get_bd_pins Convolution_Layer_32bit_0/ila_master_calculated] [get_bd_pins ila_5/probe41]
connect_bd_net [get_bd_pins Convolution_Layer_32bit_0/ila_master_ch_al_filt] [get_bd_pins ila_10/probe52]
connect_bd_net [get_bd_pins Convolution_Layer_32bit_0/ila_master_channel_counter] [get_bd_pins ila_5/probe35]
connect_bd_net [get_bd_pins Convolution_Layer_32bit_0/ila_master_channel_loop_counter] [get_bd_pins ila_5/probe45]
connect_bd_net [get_bd_pins Convolution_Layer_32bit_0/ila_master_channels_allowed] [get_bd_pins ila_5/probe51]
connect_bd_net [get_bd_pins Convolution_Layer_32bit_0/ila_master_channels_iterations] [get_bd_pins ila_10/probe55]
connect_bd_net [get_bd_pins Convolution_Layer_32bit_0/ila_master_column_counter] [get_bd_pins ila_5/probe42]
connect_bd_net [get_bd_pins Convolution_Layer_32bit_0/ila_master_conv_complete] [get_bd_pins ila_10/probe29]
connect_bd_net [get_bd_pins Convolution_Layer_32bit_0/ila_master_convolution_done] [get_bd_pins ila_6/probe3]
connect_bd_net [get_bd_pins Convolution_Layer_32bit_0/ila_master_data_written] [get_bd_pins ila_5/probe60]
connect_bd_net [get_bd_pins Convolution_Layer_32bit_0/ila_master_debug_mode] [get_bd_pins ila_6/probe1]
connect_bd_net [get_bd_pins Convolution_Layer_32bit_0/ila_master_dsps_used] [get_bd_pins ila_10/probe33]
connect_bd_net [get_bd_pins Convolution_Layer_32bit_0/ila_master_filter_counter] [get_bd_pins ila_5/probe49]
connect_bd_net [get_bd_pins Convolution_Layer_32bit_0/ila_master_filter_iterations_required] [get_bd_pins ila_10/probe37]
connect_bd_net [get_bd_pins Convolution_Layer_32bit_0/ila_master_fsm_state] [get_bd_pins ila_6/probe4]
connect_bd_net [get_bd_pins Convolution_Layer_32bit_0/ila_master_input_addr_counter] [get_bd_pins ila_5/probe27]
connect_bd_net [get_bd_pins Convolution_Layer_32bit_0/ila_master_input_arsize] [get_bd_pins ila_6/probe0]
connect_bd_net [get_bd_pins Convolution_Layer_32bit_0/ila_master_input_channel_counter] [get_bd_pins ila_5/probe38]
connect_bd_net [get_bd_pins Convolution_Layer_32bit_0/ila_master_input_data_addr_reg] [get_bd_pins ila_5/probe22]
connect_bd_net [get_bd_pins Convolution_Layer_32bit_0/ila_master_input_index] [get_bd_pins ila_5/probe54]
connect_bd_net [get_bd_pins Convolution_Layer_32bit_0/ila_master_input_volume_channels] [get_bd_pins ila_10/probe41]
connect_bd_net [get_bd_pins Convolution_Layer_32bit_0/ila_master_input_volume_height] [get_bd_pins ila_10/probe39]
connect_bd_net [get_bd_pins Convolution_Layer_32bit_0/ila_master_input_volume_row_counter] [get_bd_pins ila_5/probe34]
connect_bd_net [get_bd_pins Convolution_Layer_32bit_0/ila_master_input_volume_width] [get_bd_pins ila_10/probe40]
connect_bd_net [get_bd_pins Convolution_Layer_32bit_0/ila_master_iteration_complete] [get_bd_pins ila_10/probe31]
connect_bd_net [get_bd_pins Convolution_Layer_32bit_0/ila_master_iteration_counter] [get_bd_pins ila_5/probe44]
connect_bd_net [get_bd_pins Convolution_Layer_32bit_0/ila_master_iterations_required] [get_bd_pins ila_10/probe34]
connect_bd_net [get_bd_pins Convolution_Layer_32bit_0/ila_master_last_channel_base] [get_bd_pins ila_5/probe57]
connect_bd_net [get_bd_pins Convolution_Layer_32bit_0/ila_master_layer_ready] [get_bd_pins ila_10/probe36]
connect_bd_net [get_bd_pins Convolution_Layer_32bit_0/ila_master_more_bursts_needed] [get_bd_pins ila_5/probe43]
connect_bd_net [get_bd_pins Convolution_Layer_32bit_0/ila_master_more_dsps] [get_bd_pins ila_10/probe30]
connect_bd_net [get_bd_pins Convolution_Layer_32bit_0/ila_master_number_of_filters] [get_bd_pins ila_10/probe48]
connect_bd_net [get_bd_pins Convolution_Layer_32bit_0/ila_master_operation_complete] [get_bd_pins ila_5/probe52]
connect_bd_net [get_bd_pins Convolution_Layer_32bit_0/ila_master_out_last_channel_base] [get_bd_pins ila_5/probe58]
connect_bd_net [get_bd_pins Convolution_Layer_32bit_0/ila_master_out_volume_row_counter] [get_bd_pins ila_5/probe33]
connect_bd_net [get_bd_pins Convolution_Layer_32bit_0/ila_master_output_addr_counter] [get_bd_pins ila_5/probe28]
connect_bd_net [get_bd_pins Convolution_Layer_32bit_0/ila_master_output_base_pixel] [get_bd_pins ila_5/probe61]
connect_bd_net [get_bd_pins Convolution_Layer_32bit_0/ila_master_output_channel_counter] [get_bd_pins ila_5/probe37]
connect_bd_net [get_bd_pins Convolution_Layer_32bit_0/ila_master_output_data_addr_reg] [get_bd_pins ila_5/probe23]
connect_bd_net [get_bd_pins Convolution_Layer_32bit_0/ila_master_output_index] [get_bd_pins ila_5/probe55]
connect_bd_net [get_bd_pins Convolution_Layer_32bit_0/ila_master_output_volume_channels] [get_bd_pins ila_10/probe44]
connect_bd_net [get_bd_pins Convolution_Layer_32bit_0/ila_master_output_volume_height] [get_bd_pins ila_10/probe42]
connect_bd_net [get_bd_pins Convolution_Layer_32bit_0/ila_master_output_volume_width] [get_bd_pins ila_10/probe43]
connect_bd_net [get_bd_pins Convolution_Layer_32bit_0/ila_master_pad] [get_bd_pins ila_10/probe50]
connect_bd_net [get_bd_pins Convolution_Layer_32bit_0/ila_master_prev_addr_counter] [get_bd_pins ila_5/probe31]
connect_bd_net [get_bd_pins Convolution_Layer_32bit_0/ila_master_prev_addr_reg] [get_bd_pins ila_5/probe26]
connect_bd_net [get_bd_pins Convolution_Layer_32bit_0/ila_master_prev_channel_counter] [get_bd_pins ila_5/probe36]
connect_bd_net [get_bd_pins Convolution_Layer_32bit_0/ila_master_prev_index] [get_bd_pins ila_5/probe56]
connect_bd_net [get_bd_pins Convolution_Layer_32bit_0/ila_master_prev_last_channel_base] [get_bd_pins ila_5/probe59]
connect_bd_net [get_bd_pins Convolution_Layer_32bit_0/ila_master_rbc] [get_bd_pins ila_5/probe21]
connect_bd_net [get_bd_pins Convolution_Layer_32bit_0/ila_master_reads_remaining] [get_bd_pins ila_5/probe40]
connect_bd_net [get_bd_pins Convolution_Layer_32bit_0/ila_master_relu_en] [get_bd_pins ila_10/probe27]
connect_bd_net [get_bd_pins Convolution_Layer_32bit_0/ila_master_row_complete] [get_bd_pins ila_10/probe35]
connect_bd_net [get_bd_pins Convolution_Layer_32bit_0/ila_master_row_counter] [get_bd_pins ila_5/probe32]
connect_bd_net [get_bd_pins Convolution_Layer_32bit_0/ila_master_row_loop_counter] [get_bd_pins ila_5/probe46]
connect_bd_net [get_bd_pins Convolution_Layer_32bit_0/ila_master_start] [get_bd_pins ila_10/probe57]
connect_bd_net [get_bd_pins Convolution_Layer_32bit_0/ila_master_stride] [get_bd_pins ila_10/probe49]
connect_bd_net [get_bd_pins Convolution_Layer_32bit_0/ila_master_stride_counter] [get_bd_pins ila_5/probe48]
connect_bd_net [get_bd_pins Convolution_Layer_32bit_0/ila_master_volume_complete] [get_bd_pins ila_10/probe32]
connect_bd_net [get_bd_pins Convolution_Layer_32bit_0/ila_master_wbc] [get_bd_pins ila_5/probe20]
connect_bd_net [get_bd_pins Convolution_Layer_32bit_0/ila_master_weight_filter_channels] [get_bd_pins ila_10/probe47]
connect_bd_net [get_bd_pins Convolution_Layer_32bit_0/ila_master_weight_filter_height] [get_bd_pins ila_10/probe45]
connect_bd_net [get_bd_pins Convolution_Layer_32bit_0/ila_master_weight_filter_width] [get_bd_pins ila_10/probe46]
connect_bd_net [get_bd_pins Convolution_Layer_32bit_0/ila_master_weight_index] [get_bd_pins ila_5/probe53]
connect_bd_net [get_bd_pins Convolution_Layer_32bit_0/ila_master_weights_addr_counter] [get_bd_pins ila_5/probe29]
connect_bd_net [get_bd_pins Convolution_Layer_32bit_0/ila_master_weights_addr_reg] [get_bd_pins ila_5/probe24]
connect_bd_net [get_bd_pins Convolution_Layer_32bit_0/ila_master_weights_loaded] [get_bd_pins ila_10/probe28]
connect_bd_net [get_bd_pins Convolution_Layer_32bit_0/ila_master_writes_remaining] [get_bd_pins ila_5/probe39]
connect_bd_net [get_bd_pins Convolution_Layer_32bit_0/ila_outbuff_din] [get_bd_pins ila_10/probe24]
connect_bd_net [get_bd_pins Convolution_Layer_32bit_0/ila_outbuff_dout] [get_bd_pins ila_10/probe25]
connect_bd_net [get_bd_pins Convolution_Layer_32bit_0/ila_outbuff_empty] [get_bd_pins ila_10/probe20]
connect_bd_net [get_bd_pins Convolution_Layer_32bit_0/ila_outbuff_full] [get_bd_pins ila_10/probe21]
connect_bd_net [get_bd_pins Convolution_Layer_32bit_0/ila_outbuff_valid] [get_bd_pins ila_10/probe22]
connect_bd_net [get_bd_pins Convolution_Layer_32bit_0/ila_outbuff_wr_en] [get_bd_pins ila_10/probe23]
connect_bd_net [get_bd_pins Convolution_Layer_32bit_0/ila_prev_fifo_dout] [get_bd_pins ila_8/probe31]
connect_bd_net [get_bd_pins Convolution_Layer_32bit_0/ila_prev_fifo_empty] [get_bd_pins ila_8/probe32]
connect_bd_net [get_bd_pins Convolution_Layer_32bit_0/ila_prev_fifo_rd_en] [get_bd_pins ila_8/probe33]
connect_bd_net [get_bd_pins Convolution_Layer_32bit_0/ila_prev_fifo_valid] [get_bd_pins ila_8/probe34]
connect_bd_net [get_bd_pins Convolution_Layer_32bit_0/ila_prev_weight_data] [get_bd_pins ila_8/probe9]
connect_bd_net [get_bd_pins Convolution_Layer_32bit_0/ila_reset_weight_fifo_n] [get_bd_pins ila_8/probe35]
connect_bd_net [get_bd_pins Convolution_Layer_32bit_0/ila_router_acc_ready] [get_bd_pins ila_6/probe41]
connect_bd_net [get_bd_pins Convolution_Layer_32bit_0/ila_router_affine_complete] [get_bd_pins ila_6/probe44]
connect_bd_net [get_bd_pins Convolution_Layer_32bit_0/ila_router_affine_en] [get_bd_pins ila_6/probe40]
connect_bd_net [get_bd_pins Convolution_Layer_32bit_0/ila_router_conv_complete] [get_bd_pins ila_6/probe43]
connect_bd_net [get_bd_pins Convolution_Layer_32bit_0/ila_router_convolution_en] [get_bd_pins ila_6/probe39]
connect_bd_net [get_bd_pins Convolution_Layer_32bit_0/ila_router_disable_channel_n] [get_bd_pins ila_6/probe38]
connect_bd_net [get_bd_pins Convolution_Layer_32bit_0/ila_router_filter_kernal_loaded] [get_bd_pins ila_6/probe42]
connect_bd_net [get_bd_pins Convolution_Layer_32bit_0/ila_router_volume_ready] [get_bd_pins ila_6/probe45]
connect_bd_net [get_bd_pins Convolution_Layer_32bit_0/ila_volume_fifo_empty] [get_bd_pins ila_6/probe17]
connect_bd_net [get_bd_pins Convolution_Layer_32bit_0/ila_volume_fifo_full] [get_bd_pins ila_6/probe18]
connect_bd_net [get_bd_pins Convolution_Layer_32bit_0/ila_volume_fifo_rd_en] [get_bd_pins ila_6/probe19]
connect_bd_net [get_bd_pins Convolution_Layer_32bit_0/ila_volume_fifo_valid] [get_bd_pins ila_6/probe20]
connect_bd_net [get_bd_pins Convolution_Layer_32bit_0/ila_volume_fifo_wr_en] [get_bd_pins ila_6/probe21]
connect_bd_net [get_bd_pins Convolution_Layer_32bit_0/ila_volume_mux_new_data_en] [get_bd_pins ila_6/probe30]
connect_bd_net [get_bd_pins Convolution_Layer_32bit_0/ila_volume_mux_prev_data_en] [get_bd_pins ila_6/probe31]
connect_bd_net [get_bd_pins Convolution_Layer_32bit_0/ila_volume_mux_prev_data_wr_en] [get_bd_pins ila_6/probe29]
connect_bd_net [get_bd_pins Convolution_Layer_32bit_0/ila_volume_mux_recycled_data_en] [get_bd_pins ila_6/probe33]
connect_bd_net [get_bd_pins Convolution_Layer_32bit_0/ila_volume_mux_recycled_data_wr_en] [get_bd_pins ila_6/probe32]
connect_bd_net [get_bd_pins Convolution_Layer_32bit_0/ila_volume_router_calc_params] [get_bd_pins ila_6/probe52]
connect_bd_net [get_bd_pins Convolution_Layer_32bit_0/ila_volume_router_column_counter] [get_bd_pins ila_6/probe61]
connect_bd_net [get_bd_pins Convolution_Layer_32bit_0/ila_volume_router_data_return_wr_en] [get_bd_pins ila_6/probe53]
connect_bd_net [get_bd_pins Convolution_Layer_32bit_0/ila_volume_router_data_valid] [get_bd_pins ila_6/probe54]
connect_bd_net [get_bd_pins Convolution_Layer_32bit_0/ila_volume_router_delay_shift_register] [get_bd_pins ila_8/probe0]
connect_bd_net [get_bd_pins Convolution_Layer_32bit_0/ila_volume_router_element_counter] [get_bd_pins ila_6/probe59]
connect_bd_net [get_bd_pins Convolution_Layer_32bit_0/ila_volume_router_empty_data_complete] [get_bd_pins ila_6/probe58]
connect_bd_net [get_bd_pins Convolution_Layer_32bit_0/ila_volume_router_empty_data_en] [get_bd_pins ila_6/probe57]
connect_bd_net [get_bd_pins Convolution_Layer_32bit_0/ila_volume_router_empty_done] [get_bd_pins ila_6/probe49]
connect_bd_net [get_bd_pins Convolution_Layer_32bit_0/ila_volume_router_filter_counter] [get_bd_pins ila_6/probe60]
connect_bd_net [get_bd_pins Convolution_Layer_32bit_0/ila_volume_router_loaded_rows_processed] [get_bd_pins ila_6/probe55]
connect_bd_net [get_bd_pins Convolution_Layer_32bit_0/ila_volume_router_pad_16bit] [get_bd_pins ila_8/probe1]
connect_bd_net [get_bd_pins Convolution_Layer_32bit_0/ila_volume_router_padded_volume_size] [get_bd_pins ila_6/probe48]
connect_bd_net [get_bd_pins Convolution_Layer_32bit_0/ila_volume_router_ready] [get_bd_pins ila_6/probe47]
connect_bd_net [get_bd_pins Convolution_Layer_32bit_0/ila_volume_router_snake_fill_complete] [get_bd_pins ila_6/probe56]
connect_bd_net [get_bd_pins Convolution_Layer_32bit_0/ila_volume_router_state] [get_bd_pins ila_6/probe46]
connect_bd_net [get_bd_pins Convolution_Layer_32bit_0/ila_volume_router_stop_stack_en] [get_bd_pins ila_6/probe51]
connect_bd_net [get_bd_pins Convolution_Layer_32bit_0/ila_volume_stack_fifo_full] [get_bd_pins ila_6/probe36]
connect_bd_net [get_bd_pins Convolution_Layer_32bit_0/ila_volume_stack_fifo_wr_en] [get_bd_pins ila_6/probe34]
connect_bd_net [get_bd_pins Convolution_Layer_32bit_0/ila_weight_fifo_empty] [get_bd_pins ila_6/probe25]
connect_bd_net [get_bd_pins Convolution_Layer_32bit_0/ila_weight_fifo_full] [get_bd_pins ila_6/probe23]
connect_bd_net [get_bd_pins Convolution_Layer_32bit_0/ila_weight_fifo_rd_en] [get_bd_pins ila_6/probe26]
connect_bd_net [get_bd_pins Convolution_Layer_32bit_0/ila_weight_fifo_valid] [get_bd_pins ila_6/probe27]
connect_bd_net [get_bd_pins Convolution_Layer_32bit_0/ila_weight_fifo_wr_en] [get_bd_pins ila_6/probe24]
connect_bd_net [get_bd_pins Convolution_Layer_32bit_0/ila_weight_mux_full] [get_bd_pins ila_8/probe14]
connect_bd_net [get_bd_pins Convolution_Layer_32bit_0/ila_weight_mux_new_data_en] [get_bd_pins ila_8/probe10]
connect_bd_net [get_bd_pins Convolution_Layer_32bit_0/ila_weight_mux_prev_data_en] [get_bd_pins ila_8/probe11]
connect_bd_net [get_bd_pins Convolution_Layer_32bit_0/ila_weight_mux_prev_data_wr_en] [get_bd_pins ila_8/probe16]
connect_bd_net [get_bd_pins Convolution_Layer_32bit_0/ila_weight_mux_recycle_filter_data_wr_en] [get_bd_pins ila_8/probe8]
connect_bd_net [get_bd_pins Convolution_Layer_32bit_0/ila_weight_mux_recycled_data_en] [get_bd_pins ila_8/probe12]
connect_bd_net [get_bd_pins Convolution_Layer_32bit_0/ila_weight_mux_wr_en] [get_bd_pins ila_8/probe15]
connect_bd_net [get_bd_pins Convolution_Layer_32bit_0/ila_weight_router_clear_weights] [get_bd_pins ila_8/probe4]
connect_bd_net [get_bd_pins Convolution_Layer_32bit_0/ila_weight_router_data_valid] [get_bd_pins ila_8/probe5]
connect_bd_net [get_bd_pins Convolution_Layer_32bit_0/ila_weight_router_delay_shift_register] [get_bd_pins ila_8/probe7]
connect_bd_net [get_bd_pins Convolution_Layer_32bit_0/ila_weight_router_filter_data_return_wr_en] [get_bd_pins ila_8/probe3]
connect_bd_net [get_bd_pins Convolution_Layer_32bit_0/ila_weight_router_filter_element_counter] [get_bd_pins ila_8/probe6]
connect_bd_net [get_bd_pins Convolution_Layer_32bit_0/ila_weight_router_ready] [get_bd_pins ila_8/probe2]
connect_bd_net [get_bd_pins Convolution_Layer_32bit_0/ila_weight_router_state] [get_bd_pins ila_6/probe50]
connect_bd_net [get_bd_pins Convolution_Layer_32bit_0/o_convolution_done] [get_bd_pins microblaze_0_xlconcat/In0] [get_bd_pins ila_10/probe58]
connect_bd_net [get_bd_pins Convolution_Layer_32bit_0/o_cycle] \
  [get_bd_pins ila_5/probe62] [get_bd_pins ila_6/probe62] [get_bd_pins ila_10/probe59] [get_bd_pins ila_8/probe62] \
  [get_bd_pins ila_0/probe62] [get_bd_pins ila_1/probe30]
connect_bd_net [get_bd_pins Convolution_Layer_32bit_0/o_epoch] \
  [get_bd_pins ila_5/probe63] [get_bd_pins ila_6/probe63] [get_bd_pins ila_10/probe60] [get_bd_pins ila_8/probe63] \
  [get_bd_pins ila_0/probe63] [get_bd_pins ila_1/probe31]
connect_bd_net [get_bd_pins clk_wiz_0/clk_out3] [get_bd_pins mig_7series_0/clk_ref_i]
connect_bd_net [get_bd_pins clk_wiz_0/locked] [get_bd_pins rst_clk_wiz_0_100M/dcm_locked]
connect_bd_net -net clock_rtl_1 [get_bd_ports i_sys_clk] [get_bd_pins clk_wiz_0/clk_in1]
connect_bd_net [get_bd_pins mdm_1/Debug_SYS_Rst] [get_bd_pins rst_clk_wiz_0_100M/mb_debug_sys_rst]
connect_bd_net -net microblaze_0_Clk [get_bd_pins clk_wiz_0/clk_out1] \
  [get_bd_pins microblaze_0_axi_intc/s_axi_aclk] [get_bd_pins microblaze_0_axi_intc/processor_clk] \
  [get_bd_pins rst_clk_wiz_0_100M/slowest_sync_clk] [get_bd_pins xadc_wiz_0/s_axi_aclk] \
  [get_bd_pins axi_uartlite_0/s_axi_aclk] [get_bd_pins microblaze_0/Clk] [get_bd_pins mdm_1/M_AXI_ACLK] \
  [get_bd_pins ila_5/clk] [get_bd_pins ila_6/clk] [get_bd_pins ila_8/clk] [get_bd_pins ila_10/clk] \
  [get_bd_pins mig_7series_0/sys_clk_i] [get_bd_pins ila_0/clk] [get_bd_pins ila_1/clk] \
  [get_bd_pins Convolution_Layer_32bit_0/m00_axi_aclk] [get_bd_pins Convolution_Layer_32bit_0/s00_axi_aclk] \
  [get_bd_pins microblaze_0_axi_periph/ACLK] [get_bd_pins microblaze_0_axi_periph/S00_ACLK] \
  [get_bd_pins microblaze_0_axi_periph/M00_ACLK] [get_bd_pins microblaze_0_axi_periph/M01_ACLK] \
  [get_bd_pins microblaze_0_axi_periph/M02_ACLK] [get_bd_pins microblaze_0_axi_periph/M03_ACLK] \
  [get_bd_pins axi_mem_intercon/S00_ACLK] [get_bd_pins axi_mem_intercon/ACLK] [get_bd_pins axi_mem_intercon/S01_ACLK] \
  [get_bd_pins axi_mem_intercon/S02_ACLK] [get_bd_pins axi_mem_intercon/S03_ACLK] \
  [get_bd_pins microblaze_0_local_memory/LMB_Clk]
connect_bd_net -net microblaze_0_intr [get_bd_pins microblaze_0_xlconcat/dout] [get_bd_pins microblaze_0_axi_intc/intr]
connect_bd_net -net reset_rtl_1 [get_bd_ports i_reset_n] \
  [get_bd_pins clk_wiz_0/resetn] [get_bd_pins rst_clk_wiz_0_100M/ext_reset_in] [get_bd_pins mig_7series_0/sys_rst] \
  [get_bd_pins Convolution_Layer_32bit_0/i_ext_reset_n]
connect_bd_net [get_bd_pins rst_clk_wiz_0_100M/bus_struct_reset] [get_bd_pins microblaze_0_local_memory/SYS_Rst]
connect_bd_net [get_bd_pins rst_clk_wiz_0_100M/interconnect_aresetn] \
  [get_bd_pins microblaze_0_axi_periph/ARESETN] [get_bd_pins axi_mem_intercon/ARESETN]
connect_bd_net [get_bd_pins rst_clk_wiz_0_100M/mb_reset] [get_bd_pins microblaze_0_axi_intc/processor_rst] [get_bd_pins microblaze_0/Reset]
connect_bd_net [get_bd_pins rst_clk_wiz_0_100M/peripheral_aresetn] \
  [get_bd_pins microblaze_0_axi_intc/s_axi_aresetn] [get_bd_pins xadc_wiz_0/s_axi_aresetn] \
  [get_bd_pins axi_uartlite_0/s_axi_aresetn] [get_bd_pins mdm_1/M_AXI_ARESETN] \
  [get_bd_pins Convolution_Layer_32bit_0/m00_axi_aresetn] [get_bd_pins Convolution_Layer_32bit_0/s00_axi_aresetn] \
  [get_bd_pins microblaze_0_axi_periph/S00_ARESETN] [get_bd_pins microblaze_0_axi_periph/M00_ARESETN] \
  [get_bd_pins microblaze_0_axi_periph/M01_ARESETN] [get_bd_pins microblaze_0_axi_periph/M02_ARESETN] \
  [get_bd_pins microblaze_0_axi_periph/M03_ARESETN] [get_bd_pins axi_mem_intercon/S00_ARESETN] \
  [get_bd_pins axi_mem_intercon/S01_ARESETN] [get_bd_pins axi_mem_intercon/S02_ARESETN] \
  [get_bd_pins axi_mem_intercon/S03_ARESETN]
connect_bd_net [get_bd_pins xadc_wiz_0/temp_out] [get_bd_pins mig_7series_0/device_temp_i]
connect_bd_net [get_bd_pins mig_7series_0/ui_clk] [get_bd_pins rst_mig_7series_0_100M/slowest_sync_clk] [get_bd_pins axi_mem_intercon/M00_ACLK]
connect_bd_net [get_bd_pins mig_7series_0/mmcm_locked] [get_bd_pins rst_mig_7series_0_100M/dcm_locked]
connect_bd_net [get_bd_pins mig_7series_0/ui_clk_sync_rst] [get_bd_pins rst_mig_7series_0_100M/ext_reset_in]
connect_bd_net [get_bd_pins rst_mig_7series_0_100M/peripheral_aresetn] [get_bd_pins mig_7series_0/aresetn] [get_bd_pins axi_mem_intercon/M00_ARESETN]
connect_bd_net [get_bd_pins xlconstant_0/dout] [get_bd_pins microblaze_0_xlconcat/In1] [get_bd_pins microblaze_0_xlconcat/In2]
connect_bd_net [get_bd_pins Convolution_Layer_32bit_0/ila_accumulator_state] [get_bd_pins ila_8/probe36]
connect_bd_net [get_bd_pins Convolution_Layer_32bit_0/ila_accumulator_products_array_valid] [get_bd_pins ila_8/probe37]
connect_bd_net [get_bd_pins Convolution_Layer_32bit_0/ila_accumulator_kernel_element_counter] [get_bd_pins ila_8/probe38]
connect_bd_net [get_bd_pins Convolution_Layer_32bit_0/ila_accumulator_delay_shift_register] [get_bd_pins ila_8/probe39]
connect_bd_net [get_bd_pins Convolution_Layer_32bit_0/ila_accumulator_kernel_delay_shift_register] [get_bd_pins ila_8/probe40]
connect_bd_net [get_bd_pins Convolution_Layer_32bit_0/ila_accumulator_acc_ready] [get_bd_pins ila_8/probe41]
connect_bd_net [get_bd_pins Convolution_Layer_32bit_0/ila_accumulator_acc_complete] [get_bd_pins ila_8/probe42]
connect_bd_net [get_bd_pins Convolution_Layer_32bit_0/ila_accumulator_acc_valid] [get_bd_pins ila_8/probe43]
connect_bd_net [get_bd_pins Convolution_Layer_32bit_0/ila_accumulator_acc_data] [get_bd_pins ila_8/probe44]
connect_bd_net [get_bd_pins Convolution_Layer_32bit_0/ila_accumulator_column_counter] [get_bd_pins ila_8/probe45]
connect_bd_net [get_bd_pins Convolution_Layer_32bit_0/ila_accumulator_filter_counter] [get_bd_pins ila_8/probe46]
connect_bd_net [get_bd_pins Convolution_Layer_32bit_0/ila_accumulator_kernel_flag] [get_bd_pins ila_8/probe47]
connect_bd_net [get_bd_pins Convolution_Layer_32bit_0/ila_accumulator_que_acc_data] [get_bd_pins ila_8/probe48]
connect_bd_net [get_bd_pins Convolution_Layer_32bit_0/ila_accumulator_que_acc_valid] [get_bd_pins ila_8/probe49]
connect_bd_net [get_bd_pins Convolution_Layer_32bit_0/ila_accumulator_que_fifo_din] [get_bd_pins ila_8/probe50]
connect_bd_net [get_bd_pins Convolution_Layer_32bit_0/ila_accumulator_que_fifo_wr_en] [get_bd_pins ila_8/probe51]
connect_bd_net [get_bd_pins Convolution_Layer_32bit_0/ila_accumulator_que_fifo_rd_en] [get_bd_pins ila_8/probe52]
connect_bd_net [get_bd_pins Convolution_Layer_32bit_0/ila_accumulator_que_fifo_dout] [get_bd_pins ila_8/probe53]
connect_bd_net [get_bd_pins Convolution_Layer_32bit_0/ila_accumulator_que_fifo_full] [get_bd_pins ila_8/probe54]
connect_bd_net [get_bd_pins Convolution_Layer_32bit_0/ila_accumulator_que_fifo_empty] [get_bd_pins ila_8/probe56]
connect_bd_net [get_bd_pins Convolution_Layer_32bit_0/ila_accumulator_que_fifo_valid] [get_bd_pins ila_8/probe58]
connect_bd_net [get_bd_pins Convolution_Layer_32bit_0/ila_accumulator_channels_allowed_counter] [get_bd_pins ila_8/probe59]
connect_bd_net [get_bd_pins Convolution_Layer_32bit_0/ila_accumulator_filter_size_counter] [get_bd_pins ila_8/probe60]
connect_bd_net [get_bd_pins Convolution_Layer_32bit_0/ila_accumulator_channels_filt_counter] [get_bd_pins ila_8/probe61]
connect_bd_net [get_bd_pins Convolution_Layer_32bit_0/ila_acc_relay_state] [get_bd_pins ila_0/probe0]
connect_bd_net [get_bd_pins Convolution_Layer_32bit_0/ila_acc_relay_complete] [get_bd_pins ila_0/probe1]
connect_bd_net [get_bd_pins Convolution_Layer_32bit_0/ila_acc_relay_volume_processed] [get_bd_pins ila_0/probe2]
connect_bd_net [get_bd_pins Convolution_Layer_32bit_0/ila_acc_relay_iteration_complete] [get_bd_pins ila_0/probe3]
connect_bd_net [get_bd_pins Convolution_Layer_32bit_0/ila_acc_relay_filter_counter] [get_bd_pins ila_0/probe4]
connect_bd_net [get_bd_pins Convolution_Layer_32bit_0/ila_acc_relay_output_pixel_counter] [get_bd_pins ila_0/probe5]
connect_bd_net [get_bd_pins Convolution_Layer_32bit_0/ila_acc_relay_volume_row_counter] [get_bd_pins ila_0/probe6]
connect_bd_net [get_bd_pins Convolution_Layer_32bit_0/ila_acc_relay_adder_counter] [get_bd_pins ila_0/probe7]
connect_bd_net [get_bd_pins Convolution_Layer_32bit_0/ila_acc_relay_addend] [get_bd_pins ila_0/probe8]
connect_bd_net [get_bd_pins Convolution_Layer_32bit_0/ila_acc_relay_augend] [get_bd_pins ila_0/probe9]
connect_bd_net [get_bd_pins Convolution_Layer_32bit_0/ila_acc_relay_sum_result] [get_bd_pins ila_0/probe10]
connect_bd_net [get_bd_pins Convolution_Layer_32bit_0/ila_acc_relay_first_channel_set_complete] [get_bd_pins ila_0/probe11]
connect_bd_net [get_bd_pins Convolution_Layer_32bit_0/ila_acc_relay_volume_data] [get_bd_pins ila_0/probe12]
connect_bd_net [get_bd_pins Convolution_Layer_32bit_0/ila_acc_relay_bias_data] [get_bd_pins ila_0/probe13]
connect_bd_net [get_bd_pins Convolution_Layer_32bit_0/ila_acc_relay_prev_data] [get_bd_pins ila_0/probe14]
connect_bd_net [get_bd_pins Convolution_Layer_32bit_0/ila_acc_relay_iteration_counter] [get_bd_pins ila_0/probe15]
connect_bd_net [get_bd_pins Convolution_Layer_32bit_0/ila_acc_relay_bias_read] [get_bd_pins ila_0/probe16]
connect_bd_net [get_bd_pins Convolution_Layer_32bit_0/ila_acc_relay_prev_read] [get_bd_pins ila_0/probe17]
connect_bd_net [get_bd_pins Convolution_Layer_32bit_0/ila_acc_relay_filter_iteration_counter] [get_bd_pins ila_0/probe18]
connect_bd_net [get_bd_pins Convolution_Layer_32bit_0/ila_acc_relay_affine_en] [get_bd_pins ila_0/probe19]
connect_bd_net [get_bd_pins Convolution_Layer_32bit_0/ila_controller_state] [get_bd_pins ila_0/probe20]
connect_bd_net [get_bd_pins Convolution_Layer_32bit_0/ila_controller_filter_iterations_required] [get_bd_pins ila_0/probe21]
connect_bd_net [get_bd_pins Convolution_Layer_32bit_0/ila_controller_filters_in_set] [get_bd_pins ila_0/probe22]
connect_bd_net [get_bd_pins Convolution_Layer_32bit_0/ila_controller_accumulator_en] [get_bd_pins ila_0/probe23]
connect_bd_net [get_bd_pins Convolution_Layer_32bit_0/ila_controller_fifo_clear] [get_bd_pins ila_0/probe24]
connect_bd_net [get_bd_pins Convolution_Layer_32bit_0/ila_controller_channels_allowed] [get_bd_pins ila_0/probe25]
connect_bd_net [get_bd_pins Convolution_Layer_32bit_0/ila_controller_more_dsps_needed] [get_bd_pins ila_0/probe26]
connect_bd_net [get_bd_pins Convolution_Layer_32bit_0/ila_controller_operation_complete] [get_bd_pins ila_0/probe27]
connect_bd_net [get_bd_pins Convolution_Layer_32bit_0/ila_controller_num_iterations] [get_bd_pins ila_0/probe28]
connect_bd_net [get_bd_pins Convolution_Layer_32bit_0/ila_controller_all_channels_processed] [get_bd_pins ila_0/probe29]
connect_bd_net [get_bd_pins Convolution_Layer_32bit_0/ila_controller_input_volume_row_counter] [get_bd_pins ila_0/probe30]
connect_bd_net [get_bd_pins Convolution_Layer_32bit_0/ila_controller_volume_channel_counter] [get_bd_pins ila_0/probe31]
connect_bd_net [get_bd_pins Convolution_Layer_32bit_0/ila_controller_weight_channel_counter] [get_bd_pins ila_0/probe32]
connect_bd_net [get_bd_pins Convolution_Layer_32bit_0/ila_controller_filter_row_counter] [get_bd_pins ila_0/probe33]
